# Altium project Position2Go_V1.3.PrjPcb
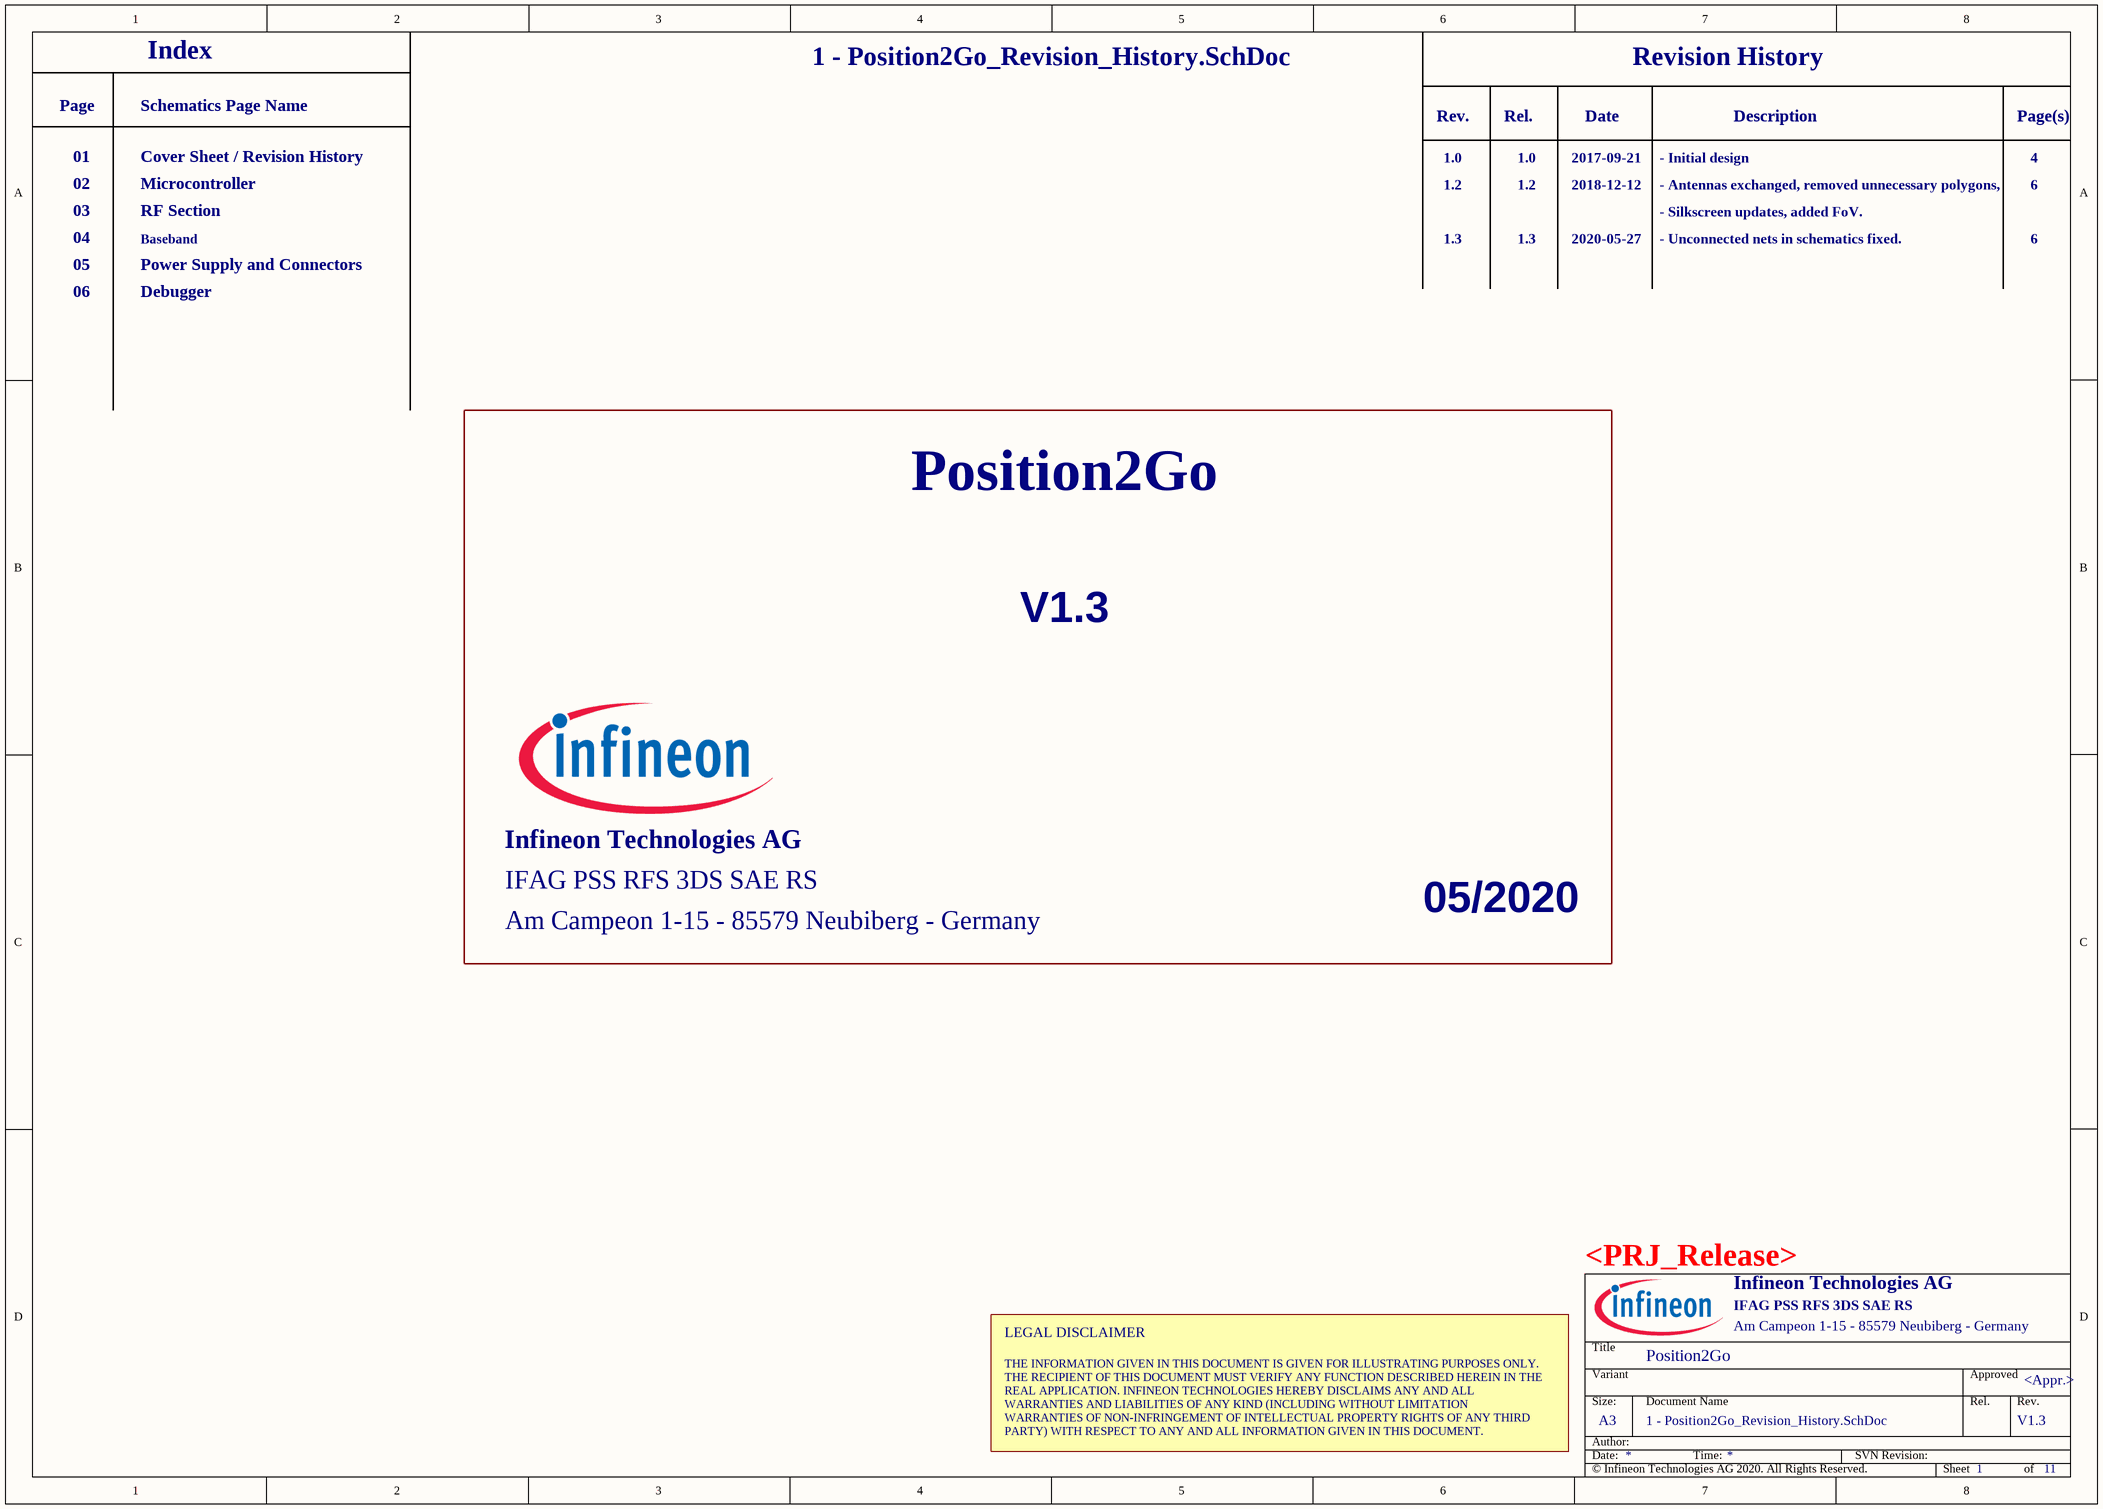
[diagram p0: 1 - Position2Go_Revision_History.SchDoc]
PRJ_Address1: IFAG PSS RFS 3DS SAE RS; PRJ_Address2: Am Campeon 1-15 - 85579 Neubiberg - Germany; PRJ_ConfidentialStatus: <PRJ_Release>; PRJ_Copyright: © Infineon Technologies AG 2020. All Rights Reserved.; PRJ_Organization: Infineon Technologies AG; PRJ_PCB_Release: V1.2; PRJ_PCB_Revision: V1.2; PRJ_SCH_Authon: Infineon Radar Team; PRJ_SCH_Revision: V1.3; PRJ_Title: Position2Go; PRJ_Year: 05/2020
6 sheets, 273 parts. Net scope: flat (ports and power ports of the same name join across sheets).
Board file: Position2Go_V1.2.PcbDoc
Sheets:
  1 - Position2Go_Revision_History.SchDoc
  2 - Position2Go_Microcontroller.SchDoc
  3 - Position2Go_RF_Section.SchDoc
  4 - Position2Go_Baseband.SchDoc
  5 - Position2Go_PowerSupply_and_Connectors.SchDoc
  6 - Position2Go_Debugger.SchDoc

## Sheet 1 - Position2Go_Revision_History.SchDoc: <Project Name>
size A3; ApprovedBy: <Appr.>; Author: <Author>; CompanyName: Infineon Technologies AG; Engineer: <Rel.>; Organization: Infineon Technologies AG; Address1: IFAG PMM RFS MM AE; Address2: Am Campeon 1-12  -  85579 Neubiberg  -  Germany; Address3: 85579 Neubiberg; Address4: Germany; DocumentNumber: 1; Revision: <Rev.>; SheetNumber: 1; SheetTotal: 11; Release: RC00; PageSetup: Record=PageOptions|CenterHorizontal=True|CenterVertical=True|PrintScale=1.01|XCorrection=1.00|YCorrection=1.00|PrintKind=0|BorderSize=5000000|LeftOffset=0|BottomOffset=0|Orientation=2|PaperLength=1000|PaperWidth=1000|Scale=100|PaperSource=7|PrintQuality=-4|MediaType=1|DitherType=10|PaperKind=A3|PrintScaleMode=1; Doc_ConfidentialStatus: <Confidential>; Doc_Preliminary: <Doc_Preliminary>

### Notes on the sheet
- Page
- Schematics Page Name
- Index
- Revision History
- 01
- Cover Sheet / Revision History
- Rev.
- 1.0
- Rel.
- 2017-09-21
- Date
- - Initial design
- Description
- Page(s)
- 4
- 03
- 02
- 04
- Microcontroller
- RF Section
- Baseband
- 1.2
- 1.3
- 2018-12-12
- 2020-05-27
- - Antennas exchanged, removed unnecessary polygons,
- - Silkscreen updates, added FoV.
- - Unconnected nets in schematics fixed.
- 6
- 05
- 06
- Power Supply and Connectors
- Debugger
- LEGAL DISCLAIMER
- THE INFORMATION GIVEN IN THIS DOCUMENT IS GIVEN FOR ILLUSTRATING PURPOSES ONLY.
  THE RECIPIENT OF THIS DOCUMENT MUST VERIFY ANY FUNCTION DESCRIBED HEREIN IN THE
  REAL APPLICATION. INFINEON TECHNOLOGIES HEREBY DISCLAIMS ANY AND ALL
  WARRANTIES AND LIABILITIES OF ANY KIND (INCLUDING WITHOUT LIMITATION
  WARRANTIES OF NON-INFRINGEMENT OF INTELLECTUAL PROPERTY RIGHTS OF ANY THIRD
  PARTY) WITH RESPECT TO ANY AND ALL INFORMATION GIVEN IN THIS DOCUMENT.
- Title
- Variant
- Approved
- Date:
- Author:
- Size:
- A3
- Document Name
- Time:
- SVN Revision:
- Sheet
- of

## Sheet 2 - Position2Go_Microcontroller.SchDoc
size A3; Release: RC00; PageSetup: Record=PageOptions|CenterHorizontal=True|CenterVertical=True|PrintScale=1.01|XCorrection=1.00|YCorrection=1.00|PrintKind=0|BorderSize=5000000|LeftOffset=0|BottomOffset=0|Orientation=2|PaperLength=1000|PaperWidth=1000|Scale=100|PaperSource=7|PrintQuality=-4|MediaType=1|DitherType=10|PaperKind=A3|PrintScaleMode=1; Doc_ConfidentialStatus: <Doc_ConfidentialStatus>; Doc_Preliminary: <Doc_Preliminary>
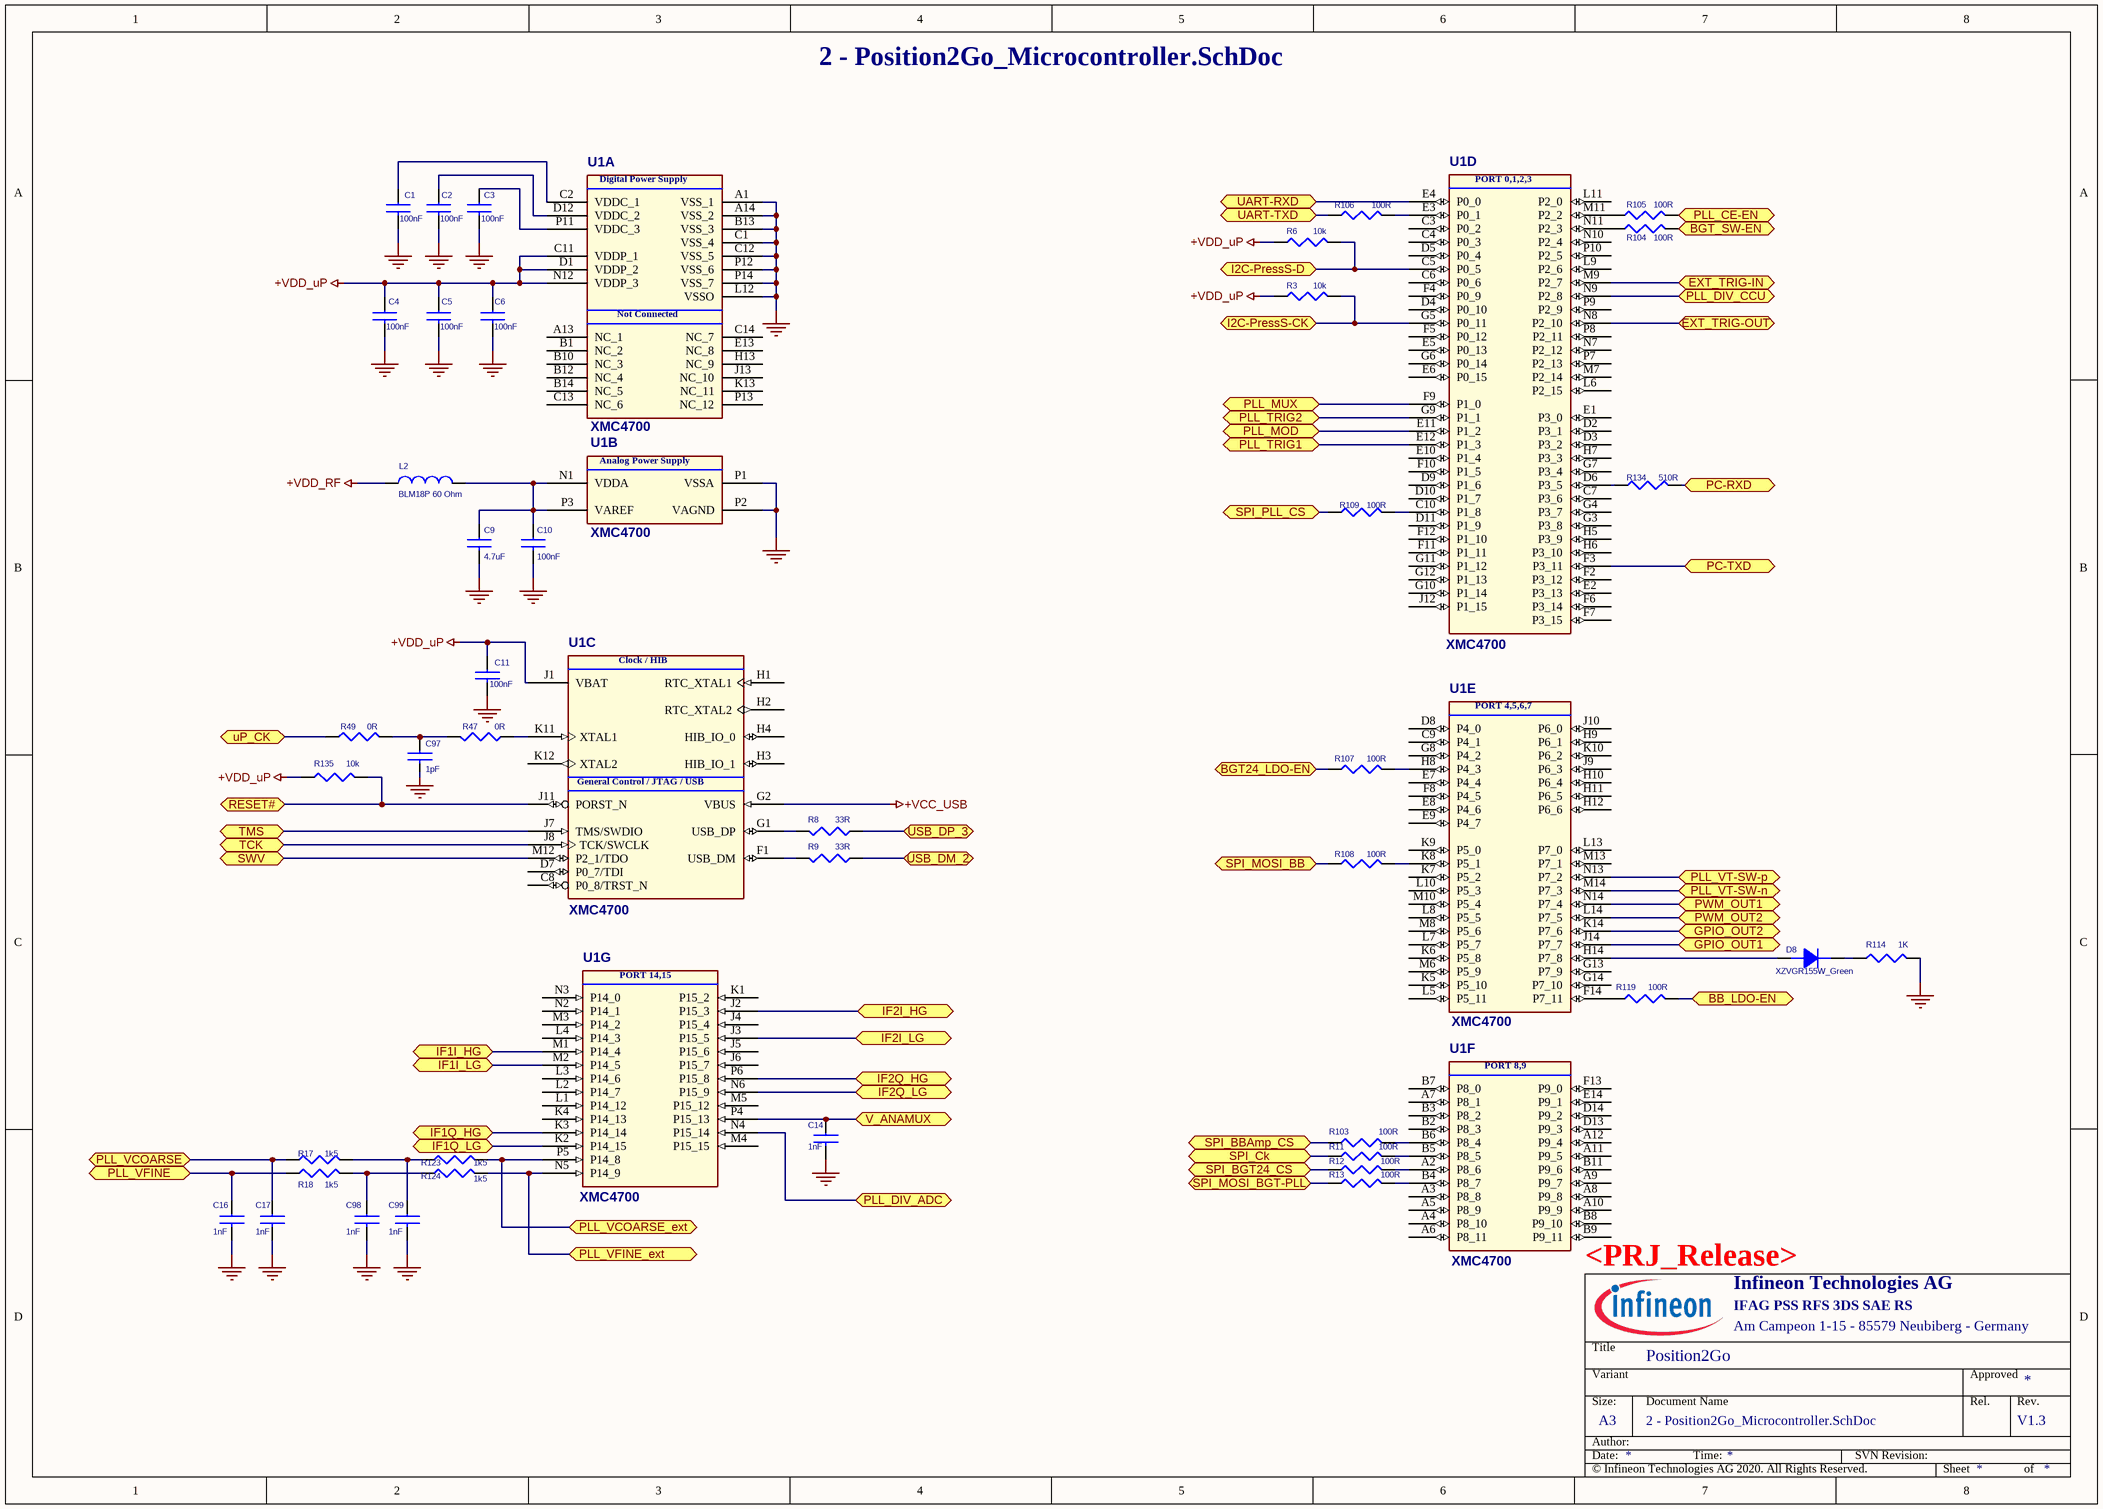
[diagram p1: 2 - Position2Go_Microcontroller.SchDoc]

### Parts
C1  100nF  [C_0201]
C2  100nF  [C_0201]
C3  100nF  [C_0201]
C4  100nF  [C_0201]
C5  100nF  [C_0201]
C6  100nF  [C_0201]
C9  4.7uF  [0402_durac]
C10  100nF  [C_0201]
C11  100nF  [C_0201]
C14  1nF  [C_0201]
C16  1nF  [C_0201]
C17  1nF  [C_0201]
C97  1pF  [C_0201]
C98  1nF  [0402_durac]
C99  1nF  [0402_durac]
D8  XZVGR155W_Green  [LED_0201]
L2  BLM18P 60 Ohm  [L_0603]
R3  10k  [R_0201]
R6  10k  [R_0201]
R8  33R  [0402_durac]
R9  33R  [0402_durac]
R11  100R  [R_0201]
R12  100R  [R_0201]
R13  100R  [R_0201]
R17  1k5  [R_0201]
R18  1k5  [R_0201]
R47  0R  [R_0201]
R49  0R  [R_0201]
R103  100R  [R_0201]
R104  100R  [R_0201]
R105  100R  [R_0201]
R106  100R  [R_0201]
R107  100R  [R_0201]
R108  100R  [R_0201]
R109  100R  [R_0201]
R114  1K  [R_0201]
R119  100R  [R_0201]
R123  1k5  [R_0201]
R124  1k5  [R_0201]
R134  510R  [0402_durac]
R135  10k  [R_0201]
U1  XMC4700  [BGA196C80P14X14_1200X1200X170]  (parts A,B,C,D,E,F,G of 7)

### Ports
BB_LDO-EN (bidir), BGT24_LDO-EN (bidir), BGT_SW-EN (bidir), EXT_TRIG-IN (bidir), EXT_TRIG-OUT (bidir), GPIO_OUT1 (bidir), GPIO_OUT2 (bidir), I2C-PressS-CK (bidir), I2C-PressS-D (bidir), IF1I_HG (bidir), IF1I_LG (bidir), IF1Q_HG (bidir), IF1Q_LG (bidir), IF2I_HG (bidir), IF2I_LG (bidir), IF2Q_HG (bidir), IF2Q_LG (bidir), PC-RXD (bidir), PC-TXD (bidir), PLL_CE-EN (bidir), PLL_DIV_ADC (bidir), PLL_DIV_CCU (bidir), PLL_MOD (bidir), PLL_MUX (bidir), PLL_TRIG1 (bidir), PLL_TRIG2 (bidir), PLL_VCOARSE (bidir), PLL_VCOARSE_ext (bidir), PLL_VFINE (bidir), PLL_VFINE_ext (bidir), PLL_VT-SW-n (bidir), PLL_VT-SW-p (bidir), PWM_OUT1 (bidir), PWM_OUT2 (bidir), RESET# (bidir), SPI_BBAmp_CS (bidir), SPI_BGT24_CS (bidir), SPI_Ck (bidir), SPI_MOSI_BB (bidir), SPI_MOSI_BGT-PLL (bidir), SPI_PLL_CS (bidir), SWV (bidir), TCK (bidir), TMS (bidir), UART-RXD (bidir), UART-TXD (bidir), uP_CK (bidir), USB_DM_2 (bidir), USB_DP_3 (bidir), V_ANAMUX (bidir)

### Nets
+VCC_USB: U1.G2(VBUS)
+VDD_RF: L2.1
+VDD_uP: C4.1 C5.1 C6.1 C11.1 R3.1 R6.2 R135.2 U1.C11(VDDP_1) U1.D1(VDDP_2) U1.J1(VBAT) U1.N12(VDDP_3)
GND_POWER: C1.2 C2.2 C3.2 C4.2 C5.2 C6.2 C9.2 C10.2 C11.2 C14.2 C16.2 C17.2 C97.2 C98.2 C99.2 R114.1 U1.A1(VSS_1) U1.A14(VSS_2) U1.B13(VSS_3) U1.C1(VSS_4) U1.C12(VSS_5) U1.L12(VSSO) U1.P1(VSSA) U1.P2(VAGND) U1.P12(VSS_6) U1.P14(VSS_7)
NetC1_1: C1.1 U1.C2(VDDC_1)
NetC2_1: C2.1 U1.D12(VDDC_2)
NetC3_1: C3.1 U1.P11(VDDC_3)
NetC9_1: C9.1 C10.1 L2.2 U1.N1(VDDA) U1.P3(VAREF)
NetC14_1: C14.1 U1.P4(P15_13) ; port V_ANAMUX
NetC16_1: C16.1 R18.1 ; port PLL_VFINE
NetC17_1: C17.1 R17.1 ; port PLL_VCOARSE
NetC43_2: R49.2 ; port uP_CK
NetC47_2: U1.M2(P14_5) ; port IF1I_LG
NetC56_2: U1.K2(P14_15) ; port IF1Q_LG
NetC66_2: U1.J3(P15_5) ; port IF2I_LG
NetC73_2: U1.N6(P15_9) ; port IF2Q_LG
NetC93_1: U1.J2(P15_3) ; port IF2I_HG
NetC94_1: U1.P6(P15_8) ; port IF2Q_HG
NetC95_1: U1.K3(P14_14) ; port IF1Q_HG
NetC96_1: U1.M1(P14_4) ; port IF1I_HG
NetC97_1: C97.1 R47.2 R49.1
NetC98_1: C98.1 R18.2 R124.1
NetC99_1: C99.1 R17.2 R123.1
NetD8_1: D8.1(K) R114.2
NetD8_2: D8.2(A) U1.H14(P7_8)
NetJ1_1: R109.2 ; port SPI_PLL_CS
NetJ1_2: R13.1 ; port SPI_MOSI_BGT-PLL
NetJ1_3: R11.1 ; port SPI_Ck
NetJ1_4: R12.1 ; port SPI_BGT24_CS
NetJ1_6: R106.1 ; port UART-TXD
NetJ1_7: U1.E4(P0_0) ; port UART-RXD
NetJ1_8: U1.J14(P7_7) ; port GPIO_OUT1
NetJ1_9: U1.M9(P2_7) ; port EXT_TRIG-IN
NetJ1_10: U1.K14(P7_6) ; port GPIO_OUT2
NetJ1_11: U1.L14(P7_5) ; port PWM_OUT2
NetJ1_12: U1.N14(P7_4) ; port PWM_OUT1
NetJ2_3: R123.2 U1.P5(P14_8) ; port PLL_VCOARSE_ext
NetJ2_4: R124.2 U1.N5(P14_9) ; port PLL_VFINE_ext
NetJ2_5: U1.F9(P1_0) ; port PLL_MUX
NetJ2_6: U1.E11(P1_2) ; port PLL_MOD
NetJ3_2: R9.1 ; port USB_DM_2
NetJ3_3: R8.1 ; port USB_DP_3
NetJ6_2: U1.J7(TMS/SWDIO) ; port TMS
NetJ6_4: U1.J8(TCK/SWCLK) ; port TCK
NetJ6_6: U1.M12(P2_1/TDO) ; port SWV
NetJ6_10: R135.1 U1.J11(PORST_N) ; port RESET#
NetQ1_3: R104.2 ; port BGT_SW-EN
NetR3_2: R3.2 U1.G5(P0_11) ; port I2C-PressS-CK
NetR6_1: R6.1 U1.C5(P0_5) ; port I2C-PressS-D
NetR8_2: R8.2 U1.G1(USB_DP)
NetR9_2: R9.2 U1.F1(USB_DM)
NetR11_2: R11.2 U1.B5(P8_5)
NetR12_2: R12.2 U1.A2(P8_6)
NetR13_2: R13.2 U1.B4(P8_7)
NetR24_1: U1.N13(P7_2) ; port PLL_VT-SW-p
NetR34_1: U1.M14(P7_3) ; port PLL_VT-SW-n
NetR37_1: U1.N9(P2_8) ; port PLL_DIV_CCU
NetR47_1: R47.1 U1.K11(XTAL1)
NetR61_2: R108.1 ; port SPI_MOSI_BB
NetR63_2: R103.1 ; port SPI_BBAmp_CS
NetR91_2: U1.F3(P3_11) ; port PC-TXD
NetR103_2: R103.2 U1.B6(P8_4)
NetR104_1: R104.1 U1.N11(P2_3)
NetR105_1: R105.1 U1.M11(P2_2)
NetR105_2: R105.2 ; port PLL_CE-EN
NetR106_2: R106.2 U1.E3(P0_1)
NetR107_1: R107.1 ; port BGT24_LDO-EN
NetR107_2: R107.2 U1.H8(P4_3)
NetR108_2: R108.2 U1.K8(P5_1)
NetR109_1: R109.1 U1.C10(P1_8)
NetR119_1: R119.1 ; port BB_LDO-EN
NetR119_2: R119.2 U1.F14(P7_11)
NetR132_1: U1.N4(P15_14) ; port PLL_DIV_ADC
NetR134_1: R134.1 U1.D6(P3_5)
NetR134_2: R134.2 ; port PC-RXD
NetU1_E12: U1.E12(P1_3) ; port PLL_TRIG1
NetU1_G9: U1.G9(P1_1) ; port PLL_TRIG2
NetU1_N8: U1.N8(P2_10) ; port EXT_TRIG-OUT

Not connected (* = marked no-connect by the designer): U1 A3(P8_8) A4(P8_10) A5(P8_9) A6(P8_11) A7(P8_1) A8(P9_8) A9(P9_7) A10(P9_9) A11(P9_5) A12(P9_4) A13(NC_1) B1(NC_2) B2(P8_3) B3(P8_2) B7(P8_0) B8(P9_10) B9(P9_11) B10(NC_3) B11(P9_6) B12(NC_4) B14(NC_5) C3(P0_2) C4(P0_3) C6(P0_6) C7(P3_6) C8(P0_8/TRST_N) C9(P4_1) C13(NC_6) C14(NC_7) D2(P3_1) D3(P3_2) D4(P0_10) D5(P0_4) D7(P0_7/TDI) D8(P4_0) D9(P1_6) D10(P1_7) D11(P1_9) D13(P9_3) D14(P9_2) E1(P3_0) E2(P3_13) E5(P0_13) E6(P0_15) E7(P4_4) E8(P4_6) E9(P4_7) E10(P1_4) E13(NC_8) E14(P9_1) F2(P3_12) F4(P0_9) F5(P0_12) F6(P3_14) F7(P3_15) F8(P4_5) F10(P1_5) F11(P1_11) F12(P1_10) F13(P9_0) G3(P3_8) G4(P3_7) G6(P0_14) G7(P3_4) G8(P4_2) G10(P1_14) G11(P1_12) G12(P1_13) G13(P7_9) G14(P7_10) H1(RTC_XTAL1) H2(RTC_XTAL2) H3(HIB_IO_1) H4(HIB_IO_0) H5(P3_9) H6(P3_10) H7(P3_3) H9(P6_1) H10(P6_4) H11(P6_5) H12(P6_6) H13(NC_9) J4(P15_4) J5(P15_6) J6(P15_7) J9(P6_3) J10(P6_0) J12(P1_15) J13(NC_10) K1(P15_2) K4(P14_13) K5(P5_10) K6(P5_8) K7(P5_2) K9(P5_0) K10(P6_2) K12(XTAL2) K13(NC_11) L1(P14_12) L2(P14_7) L3(P14_6) L4(P14_3) L5(P5_11) L6(P2_15) L7(P5_7) L8(P5_5) L9(P2_6) L10(P5_3) L11(P2_0) L13(P7_0) M3(P14_2) M4(P15_15) M5(P15_12) M6(P5_9) M7(P2_14) M8(P5_6) M10(P5_4) M13(P7_1) N2(P14_1) N3(P14_0) N7(P2_12) N10(P2_4) P7(P2_13) P8(P2_11) P9(P2_9) P10(P2_5) P13(NC_12)

### Notes on the sheet
- Title
- Variant
- Approved
- Date:
- Author:
- Size:
- A3
- Document Name
- Time:
- SVN Revision:
- Rel.
- Rev.
- Sheet
- of
- (in symbol XMC4700-E196F2048, part A) Digital Power Supply; Not Connected
- (in symbol XMC4700-E196F2048, part B) Analog Power Supply
- (in symbol XMC4700-E196F2048, part C) Clock / HIB; General Control / JTAG / USB
- (in symbol XMC4700-E196F2048, part D) PORT 0,1,2,3
- (in symbol XMC4700-E196F2048, part E) PORT 4,5,6,7
- (in symbol XMC4700-E196F2048, part F) PORT 8,9
- (in symbol XMC4700-E196F2048, part G) PORT 14,15

### Library data of the parts
C1-C6 C10 C11 = 100nF_Dup1: 100nF  ±10%  35V  X5R; code_DK: 490-10430-1-ND; Voltage: 35V; Part Type: capacitor\ceramic; Tolerance: 10%
C9 = 4.7UF: code_DK: 445-13820-1-ND; Voltage: 10V; Tolerance: 10%; Temperature coefficient: X5R; Part Type: capacitor\ceramic
C14 C16 C17 = 1nF: Tolerance: 10%; Voltage: 25V; code_DK: 445-4695-1-ND; Part Type: capacitor\ceramic
C97 = 1pF: Tolerance: ±0,1 pF; Voltage: 25V; code_DK: 712-1181-1-ND; Part Type: capacitor\ceramic
C98 C99 = 1.0nF: code_DK: 490-3244-2-ND; Voltage: 50V; Tolerance: 5%; Temperature coefficient: NP0; code_GW: GW_0144; Part Type: capacitor\ceramic; code_DK_Reel: 490-3244-2-ND
D8 = LED_0201_GREEN: code_DK_reel: 475-1193-6-ND; code_DK: 1497-1300-1-ND
L2 = blm18 p 60 ohm: code_DK: 490-1036-1-ND
R3 R6 R135 = 10K_Dup1: code_DK_reel: 311-1KMDKR-ND; code_DK: 311-10.0KMCT-ND; tolerance: 1%; Power: 0.063W; size: 0201
R8 R9 = RESISTOR: code_DK: 311-33.0LRTR-ND
R11-R13 R103-R109 R119 = 100: code_DK: 311-100MCT-ND; tolerance: 1%; Power: 0.063W; size: 0201
R17 R18 R123 R124 = 1k5: tolerance: 1%; Power: 0.063W; size: 0201
R47 R49 = 0_Dup2: code_DK: 311-0.0NCT-ND; tolerance: 1%; Power: 0.063W; size: 0201
R114 = 1K: Power: 0.063W; tolerance: 1%; code_DK: 311-1KMCT-ND; size: 0201
R134 = 510: Power: 0.063W; tolerance: 1%; code_DK: 311-510LRTR-ND; size: 0402
U1 = XMC4700-E196F2048: code_DK: XMC4700E196K2048AAXQMA1-ND

## Sheet 3 - Position2Go_RF_Section.SchDoc
size A3; Release: RC00; PageSetup: Record=PageOptions|CenterHorizontal=True|CenterVertical=True|PrintScale=1.01|XCorrection=1.00|YCorrection=1.00|PrintKind=0|BorderSize=5000000|LeftOffset=0|BottomOffset=0|Orientation=2|PaperLength=1000|PaperWidth=1000|Scale=100|PaperSource=7|PrintQuality=-4|MediaType=1|DitherType=10|PaperKind=A3|PrintScaleMode=1; Doc_ConfidentialStatus: <Doc_ConfidentialStatus>; Doc_Preliminary: <Doc_Preliminary>
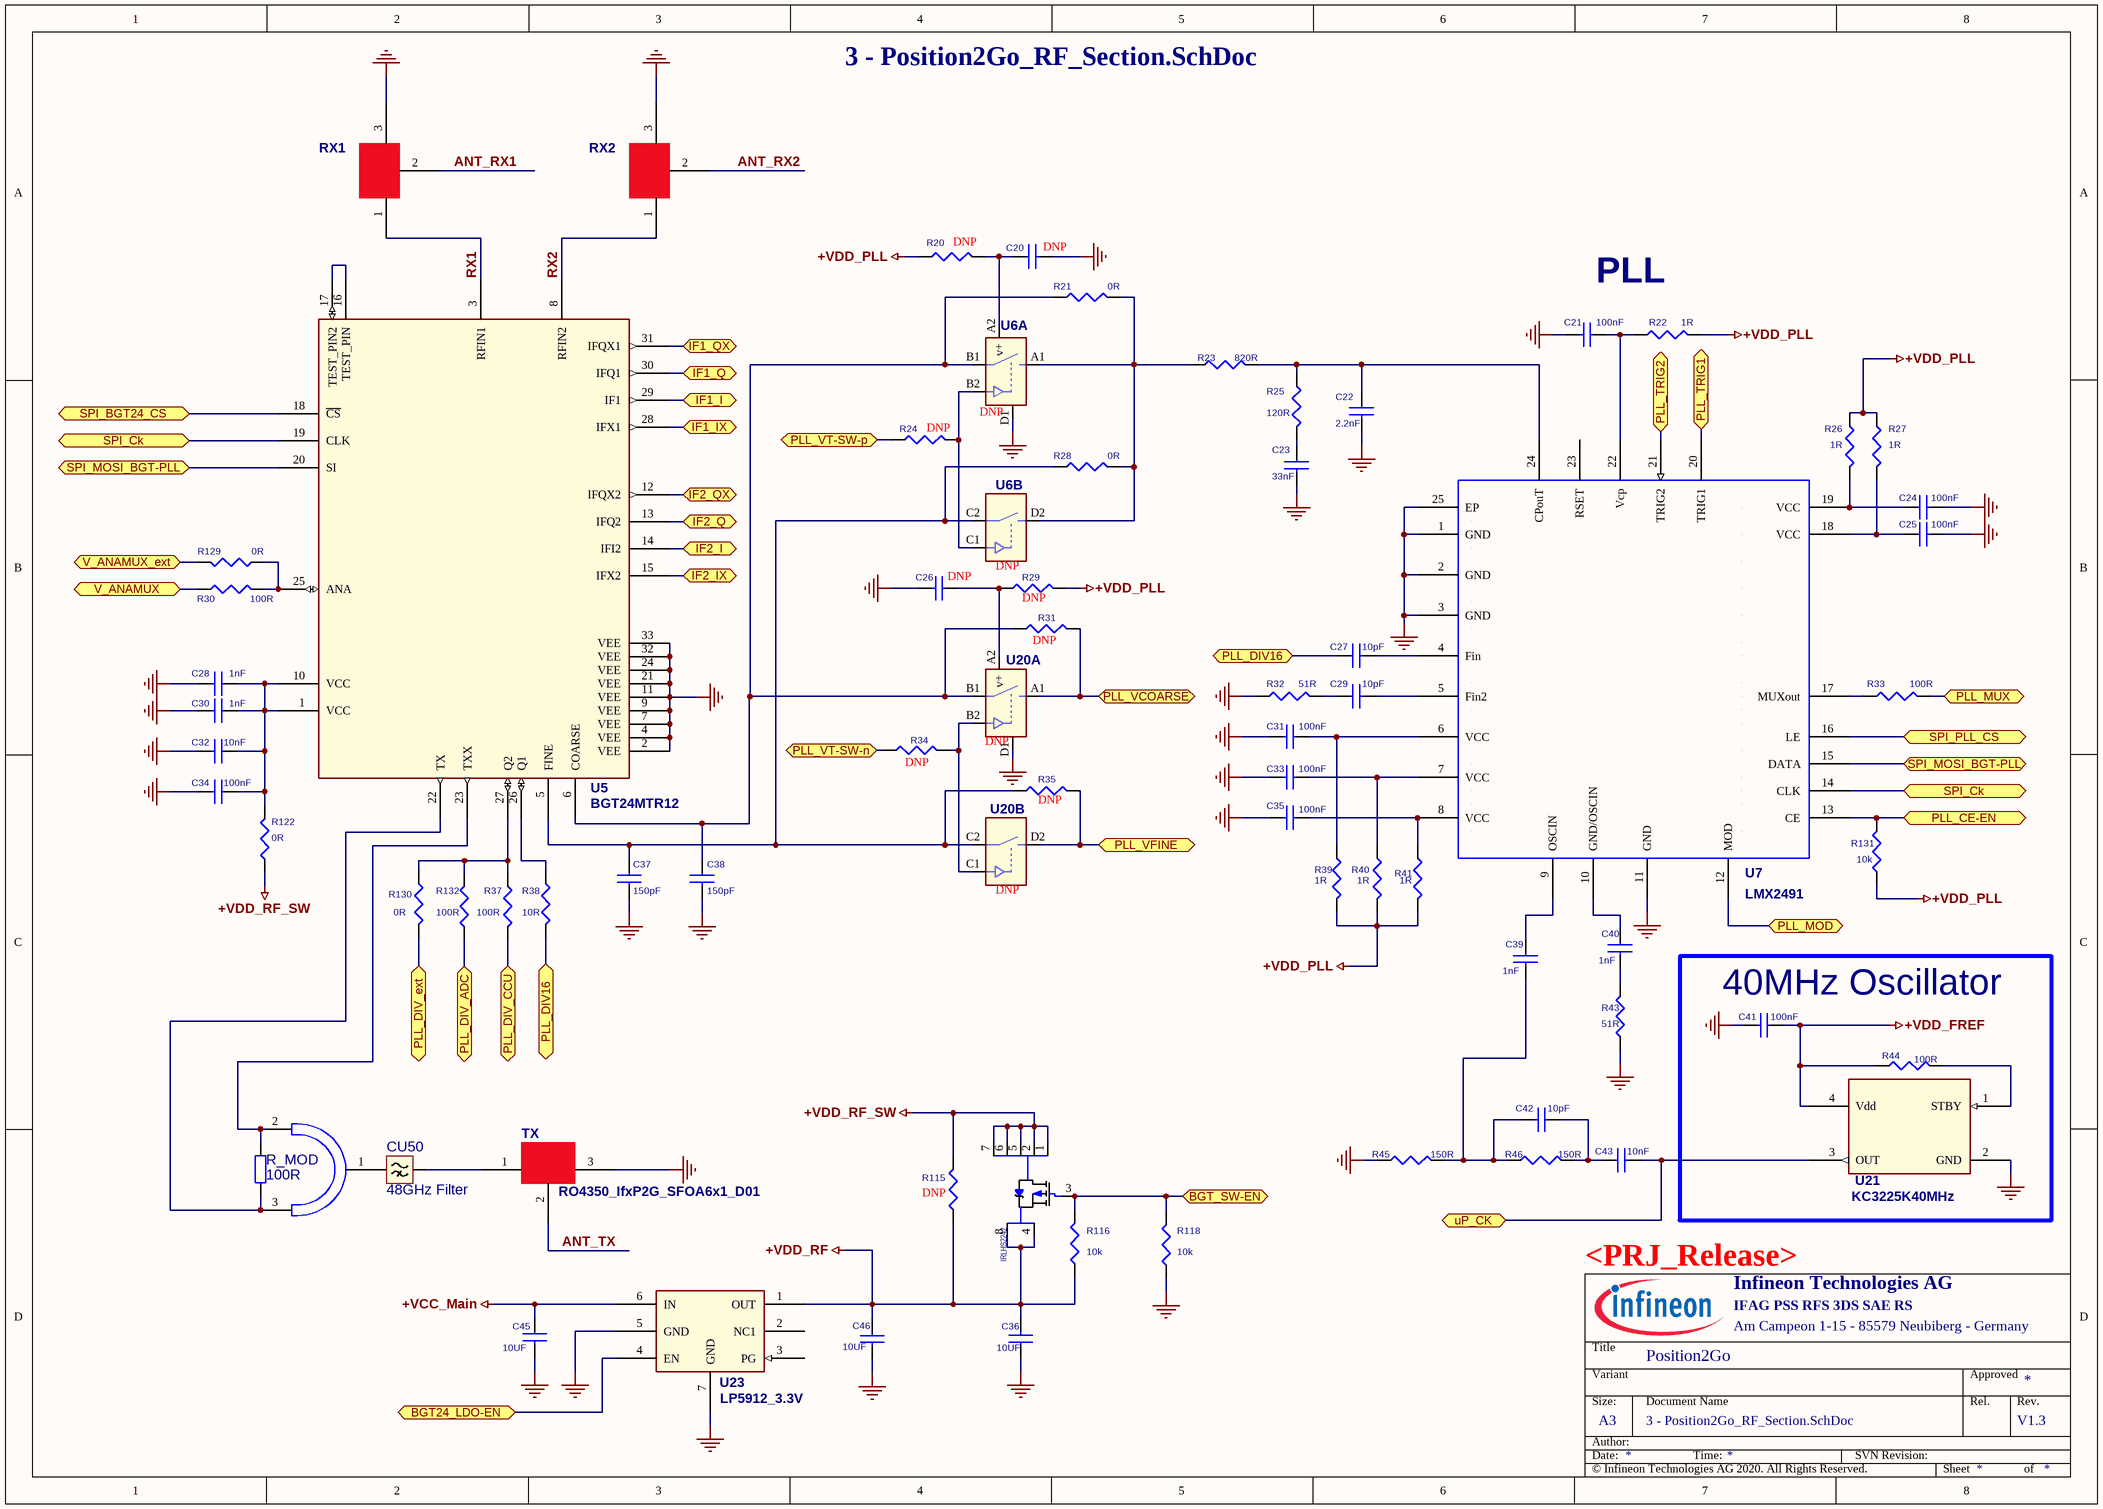
[diagram p2: 3 - Position2Go_RF_Section.SchDoc]

### Parts
C20  DNP  [C_0201]  (value not drawn)
C21  100nF  [C_0201]
C22  2.2nF  [0402_durac]
C23  33nF  [0402_durac]
C24  100nF  [C_0201]
C25  100nF  [C_0201]
C26  DNP  [C_0201]  (value not drawn)
C27  10pF  [C_0201]
C28  1nF  [C_0201]
C29  10pF  [C_0201]
C30  1nF  [C_0201]
C31  100nF  [C_0201]
C32  10nF  [C_0201]
C33  100nF  [C_0201]
C34  100nF  [C_0201]
C35  100nF  [C_0201]
C36  10UF  [0402_durac]
C37  150pF  [C_0201]
C38  150pF  [C_0201]
C39  1nF  [C_0201]
C40  1nF  [C_0201]
C41  100nF  [C_0201]
C42  10pF  [C_0201]
C43  10nF  [C_0201]
C45  10UF  [0402_durac]
C46  10UF  [0402_durac]
CU1  Divider  [WILKSON]  (value not drawn)  (net tie, no BOM)
CU50  48GHz Filter  [48GHz_Filter]  (net tie, no BOM)
Q1  IRLHS2242  [IRLSH2242]  (value not drawn)
R20  DNP  [R_0201]  (value not drawn)
R21  0R  [R_0201]
R22  1R  [R_0201]
R23  820R  [0402_durac]
R24  DNP  [R_0201]  (value not drawn)
R25  120R  [0402-A]
R26  1R  [R_0201]
R27  1R  [R_0201]
R28  0R  [R_0201]
R29  DNP  [R_0201]  (value not drawn)
R30  100R  [R_0201]
R31  DNP  [R_0201]  (value not drawn)
R32  51R  [R_0201]
R33  100R  [R_0201]
R34  DNP  [R_0201]  (value not drawn)
R35  DNP  [R_0201]  (value not drawn)
R37  100R  [R_0201]
R38  10R  [R_0201]
R39  1R  [R_0201]
R40  1R  [R_0201]
R41  1R  [R_0201]
R43  51R  [R_0201]
R44  100R  [R_0201]
R45  150R  [R_0201]
R46  150R  [R_0201]
R115  DNP  [R_0201]  (value not drawn)
R116  10k  [R_0201]
R118  10k  [R_0201]
R122  0R  [0603]
R129  0R  [R_0201]
R130  0R  [R_0201]
R131  10k  [R_0201]
R132  100R  [R_0201]
R_MOD  value 100R  [24GHZ_Wilkinson_R]  (hidden comment: RES-100R-50V-1%-0603)
RX1  RO4350_IfxP2G_SFOA6x1_D01  [RO4350_IfxP2G_SFPA6x1_D01_RX1_L]  (value not drawn)  (net tie, no BOM)
RX2  RO4350_IfxP2G_SFOA6x1_D01  [RO4350_IfxP2G_SFPA6x1_D01_RX1]  (value not drawn)  (net tie, no BOM)
TX  RO4350_IfxP2G_SFOA6x1_D01  [RO4350_IfxP2G_SFPA6x1_D01_Tx]  (net tie, no BOM)
U5  BGT24MTR12  [VQFN32-9]
U6  DNP  [OPA2376_DSBGA]  (value not drawn)  (parts A,B of 2)
U7  LMX2491  [VFQN_24]
U20  DNP  [OPA2376_DSBGA]  (value not drawn)  (parts A,B of 2)
U21  KC3225K40MHz  [3525_40MHz]
U23  LP5912_3.3V  [DRV6_1P6X1]

### Blocks framed on the sheet
40MHz Oscillator: C41 R44 U21

### Ports
BGT24_LDO-EN (bidir), BGT_SW-EN (bidir), IF1_I (bidir), IF1_IX (bidir), IF1_Q (bidir), IF1_QX (bidir), IF2_I (bidir), IF2_IX (bidir), IF2_Q (bidir), IF2_QX (bidir), PLL_CE-EN (bidir), PLL_DIV16 (bidir), PLL_DIV_ADC (bidir), PLL_DIV_CCU (bidir), PLL_DIV_ext (bidir), PLL_MOD (bidir), PLL_MUX (bidir), PLL_TRIG1 (bidir), PLL_TRIG2 (bidir), PLL_VCOARSE (bidir), PLL_VFINE (bidir), PLL_VT-SW-n (bidir), PLL_VT-SW-p (bidir), SPI_BGT24_CS (bidir), SPI_Ck (bidir), SPI_MOSI_BGT-PLL (bidir), SPI_PLL_CS (bidir), uP_CK (bidir), V_ANAMUX (bidir), V_ANAMUX_ext (bidir)

### Nets
+VCC_Main: C45.1 U23.6(IN)
+VDD_FREF: C41.1 R44.2 U21.4(Vdd)
+VDD_PLL: R20.2 R22.2 R26.1 R27.1 R29.2 R39.2 R40.2 R41.2 R131.1
+VDD_RF: C36.2 C46.1 Q1.4(source) Q1.8(source) R115.1 R116.1 U23.1(OUT)
+VDD_RF_SW: Q1.1(DRAIN) Q1.2(DRAIN) Q1.5(DRAIN) Q1.6(DRAIN) Q1.7(DRAIN) R115.2 R122.1
GND_POWER: C20.2 C21.2 C22.2 C23.2 C24.2 C25.2 C26.2 C28.2 C30.2 C31.2 C32.2 C33.2 C34.2 C35.2 C36.1 C37.2 C38.2 C41.2 C45.2 C46.2 R32.1 R43.1 R45.2 R118.1 RX1.3 RX2.3 TX.3 U5.2(VEE) U5.4(VEE) U5.7(VEE) U5.9(VEE) U5.11(VEE) U5.21(VEE) U5.24(VEE) U5.32(VEE) U5.33(VEE) U6.D1(GND) U7.1(GND) U7.2(GND) U7.3(GND) U7.11(GND) U7.25(EP) U20.D1(GND) U21.2(GND) U23.5(GND) U23.7(GND)
ANT_RX1: RX1.2
ANT_RX2: RX2.2
ANT_TX: TX.2
RX1: RX1.1 U5.3(RFIN1)
RX2: RX2.1 U5.8(RFIN2)
NetC14_1: R30.1 ; port V_ANAMUX
NetC16_1: R35.2 U20.D2(NO2) ; port PLL_VFINE
NetC17_1: R31.2 U20.A1(NO1) ; port PLL_VCOARSE
NetC20_1: C20.1 R20.1 U6.A2(v+)
NetC21_1: C21.1 R22.1 U7.22(Vcp)
NetC22_1: C22.1 R23.2 R25.1 U7.24(CPouT)
NetC23_1: C23.1 R25.2
NetC24_1: C24.1 R26.2 U7.19(VCC)
NetC25_1: C25.1 R27.2 U7.18(VCC)
NetC26_1: C26.1 R29.1 U20.A2(v+)
NetC27_1: C27.1 R38.2 ; port PLL_DIV16
NetC27_2: C27.2 U7.4(Fin)
NetC28_1: C28.1 C30.1 C32.1 C34.1 R122.2 U5.1(VCC) U5.10(VCC)
NetC29_1: C29.1 R32.2
NetC29_2: C29.2 U7.5(Fin2)
NetC31_1: C31.1 R39.1 U7.6(VCC)
NetC33_1: C33.1 R40.1 U7.7(VCC)
NetC35_1: C35.1 R41.1 U7.8(VCC)
NetC37_1: C37.1 R28.1 R35.1 U5.5(FINE) U6.C2(COM2) U20.C2(COM2)
NetC38_1: C38.1 R21.1 R31.1 U5.6(COARSE) U6.B1(COM1) U20.B1(COM1)
NetC39_1: C39.1 U7.9(OSCIN)
NetC39_2: C39.2 C42.2 R45.1 R46.2
NetC40_1: C40.1 U7.10(GND/OSCIN)
NetC40_2: C40.2 R43.2
NetC42_1: C42.1 C43.1 R46.1
NetC43_2: C43.2 U21.3(OUT) ; port uP_CK
NetC49_1: U5.28(IFX1) ; port IF1_IX
NetC52_1: U5.29(IF1) ; port IF1_I
NetC60_1: U5.31(IFQX1) ; port IF1_QX
NetC61_1: U5.30(IFQ1) ; port IF1_Q
NetC67_1: U5.15(IFX2) ; port IF2_IX
NetC70_1: U5.14(IFI2) ; port IF2_I
NetC77_1: U5.12(IFQX2) ; port IF2_QX
NetC78_1: U5.13(IFQ2) ; port IF2_Q
NetCU1_1: CU1.1(P1) CU50.2
NetCU1_2: CU1.2(P2) R_MOD.1(P1) U5.23(TXX)
NetCU1_3: CU1.3(P3) R_MOD.2(P2) U5.22(TX)
NetCU50_1: CU50.1 TX.1
NetJ1_1: U7.16(LE) ; port SPI_PLL_CS
NetJ1_2: U5.20(SI) U7.15(DATA) ; port SPI_MOSI_BGT-PLL
NetJ1_3: U5.19(CLK) U7.14(CLK) ; port SPI_Ck
NetJ1_4: U5.18(~{CS}) ; port SPI_BGT24_CS
NetJ1_5: R130.2 ; port PLL_DIV_ext
NetJ2_5: R33.2 ; port PLL_MUX
NetJ2_6: U7.12(MOD) ; port PLL_MOD
NetJ2_11: R129.2 ; port V_ANAMUX_ext
NetQ1_3: Q1.3(GATE) R116.2 R118.2 ; port BGT_SW-EN
NetR21_2: R21.2 R23.1 R28.2 U6.A1(NO1) U6.D2(NO2)
NetR24_1: R24.1 ; port PLL_VT-SW-p
NetR24_2: R24.2 U6.B2(IN1) U6.C1(IN2)
NetR30_2: R30.2 R129.1 U5.25(ANA)
NetR33_1: R33.1 U7.17(MUXout)
NetR34_1: R34.1 ; port PLL_VT-SW-n
NetR34_2: R34.2 U20.B2(IN1) U20.C1(IN2)
NetR37_1: R37.1 ; port PLL_DIV_CCU
NetR37_2: R37.2 R130.1 R132.2 U5.27(Q2)
NetR38_1: R38.1 U5.26(Q1)
NetR44_1: R44.1 U21.1(STBY)
NetR105_2: R131.2 U7.13(CE) ; port PLL_CE-EN
NetR107_1: U23.4(EN) ; port BGT24_LDO-EN
NetR132_1: R132.1 ; port PLL_DIV_ADC
NetU1_E12: U7.20(TRIG1) ; port PLL_TRIG1
NetU1_G9: U7.21(TRIG2) ; port PLL_TRIG2
NetU5_16: U5.16(TEST_PIN) U5.17(TEST_PIN2)

Not connected (* = marked no-connect by the designer): U7 23(RSET); U23 2(NC1) 3(PG)

### Notes on the sheet
- (near R20) DNP
- (near C20) DNP
- PLL
- (near R24) DNP
- (near U6) DNP
- (near C26) DNP
- DNP
- (near R29) DNP
- (near R31) DNP
- (near R34) DNP
- (near U20) DNP
- (near R35) DNP
- (near R115) DNP
- Title
- Variant
- Approved
- Date:
- Author:
- Size:
- A3
- Document Name
- Time:
- SVN Revision:
- Rel.
- Rev.
- Sheet
- of

### Library data of the parts
C20 C26 = 100nF_Dup1: NB Not Fitted; code_DK: 490-10430-1-ND; Voltage: 50V; Tolerance: 5%; Part Type: capacitor\ceramic
C21 C24 C25 C31 C33-C35 C41 = 100nF_Dup1: code_DK: 490-10430-1-ND; Voltage: 50V; Tolerance: 5%; Part Type: capacitor\ceramic
C22 = 3.9nF: Voltage: 50V; Tolerance: 5%; Temperature coefficient: COG/NPO; Part Type: capacitor\ceramic
C23 = 68nF: Temperature coefficient: X7R; Tolerance: 10%; Voltage: 50V; Part Type: capacitor\ceramic
C27 C29 C42 = 10pF: 10pF  ±1%  50V  NPO; code_DK: 490-7750-1-ND; Voltage: 50V; Part Type: capacitor\ceramic; Tolerance: 1%
C28 C30 C39 C40 = 1nF: as C14 on sheet 2 - Position2Go_Microcontroller; Part Type: capacitor\ceramic
C32 C43 = 10nF: Tolerance: 10%; Voltage: 10V; code_DK: 490-7223-1-ND; Part Type: capacitor\ceramic
C36 C45 C46 = 10UF: Temperature coefficient: X5R; Tolerance: 20%; Voltage: 10V; code_DK: 1276-1450-1-ND; Part Type: capacitor\ceramic
C37 C38 = 100pF: 150pF  ±5%  25V  NPO; code_DK: 587-3799-1-ND; Tolerance: 5%; Part Type: capacitor\ceramic; Voltage: 25V
CU1 = WILKINSON: Preis: 0.0; FootprintBOM: -
CU50 = 48GHz_Filter: Preis: 0.0; FootprintBOM: -
Q1 = IRLHS2242: code_DK: IRLHS2242TRPBFCT-ND
R20 R29 R31 R35 R115 = 0_Dup2: NB Not Fitted; code_DK: 311-0.0NCT-ND; tolerance: 1%; Power: 0.063W; size: 0201
R21 R28 R129 R130 = 0_Dup2: as R47 on sheet 2 - Position2Go_Microcontroller; size: 0201
R22 R26 R27 R39-R41 = 1: Power: 0.063W; tolerance: 1%; code_DK: YAG3368CT-ND; size: 0201
R23 = 0_Dup1: Power: 0.063W; tolerance: 5%; size: 0402
R24 R34 = 100: NB Not Fitted; code_DK: 311-100MCT-ND; tolerance: 1%; Power: 0.063W; size: 0201
R25 = 20: Power: 0.063W; tolerance: 1%; size: 0402
R30 R33 R37 R44 R132 = 100: as R11 on sheet 2 - Position2Go_Microcontroller; size: 0201
R32 R43 = 51: code_DK: YAG2288CT-ND; tolerance: 1%; Power: 0.063W; size: 0201
R38 = 10: code_DK: 541-10.0ABCT-ND; tolerance: 1%; Power: 0.063W; size: 0201
R45 R46 = 150: tolerance: 1%; Power: 0.063W; size: 0201
R116 R118 R131 = 10K_Dup1: as R3 on sheet 2 - Position2Go_Microcontroller; size: 0201
R122 = 0: 0R 0603; code_DK: MCT0603-0.0-ZZDKR-ND; tolerance: 1%; Power: 0.125W; size: 0603
R_MOD = WILKINSON_0402: Resistor; Manufacturer: Multicomp; Bestellnummer: 9330364; Preis: 0.007; FootprintBOM: 0402; Link: http://de.farnell.com/multicomp/mc0063w06031100r/widerstand-100r-0-063w-1-0603/dp/9330364
U5 = BGT24ATR12: code_DK: BGT24MTR12E6327XUMA1CT-ND
U6 U20 = TS5A23166_DSBGA: NB Not Fitted; code_DK: 296-21183-1-ND
U7 = LMX2491: IsHeterogeneous: False; DevicesInView: 1; DeviceDesignator: A; DeviceNumbering: Alpha; OriginalSymbolOrigin: (30000,20000); code_DK: 296-45092-1-ND; DevicesInPackage: 1
U21 = K3525_40MHz: code_DK: 1253-1412-1-ND
U23 = LP5912_3_3V: code_DK: 296-44153-1-ND

## Sheet 4 - Position2Go_Baseband.SchDoc
size A3; Release: RC00; PageSetup: Record=PageOptions|CenterHorizontal=True|CenterVertical=True|PrintScale=1.01|XCorrection=1.00|YCorrection=1.00|PrintKind=0|BorderSize=5000000|LeftOffset=0|BottomOffset=0|Orientation=2|PaperLength=1000|PaperWidth=1000|Scale=100|PaperSource=7|PrintQuality=-4|MediaType=1|DitherType=10|PaperKind=A3|PrintScaleMode=1; Doc_ConfidentialStatus: <Doc_ConfidentialStatus>; Doc_Preliminary: <Doc_Preliminary>
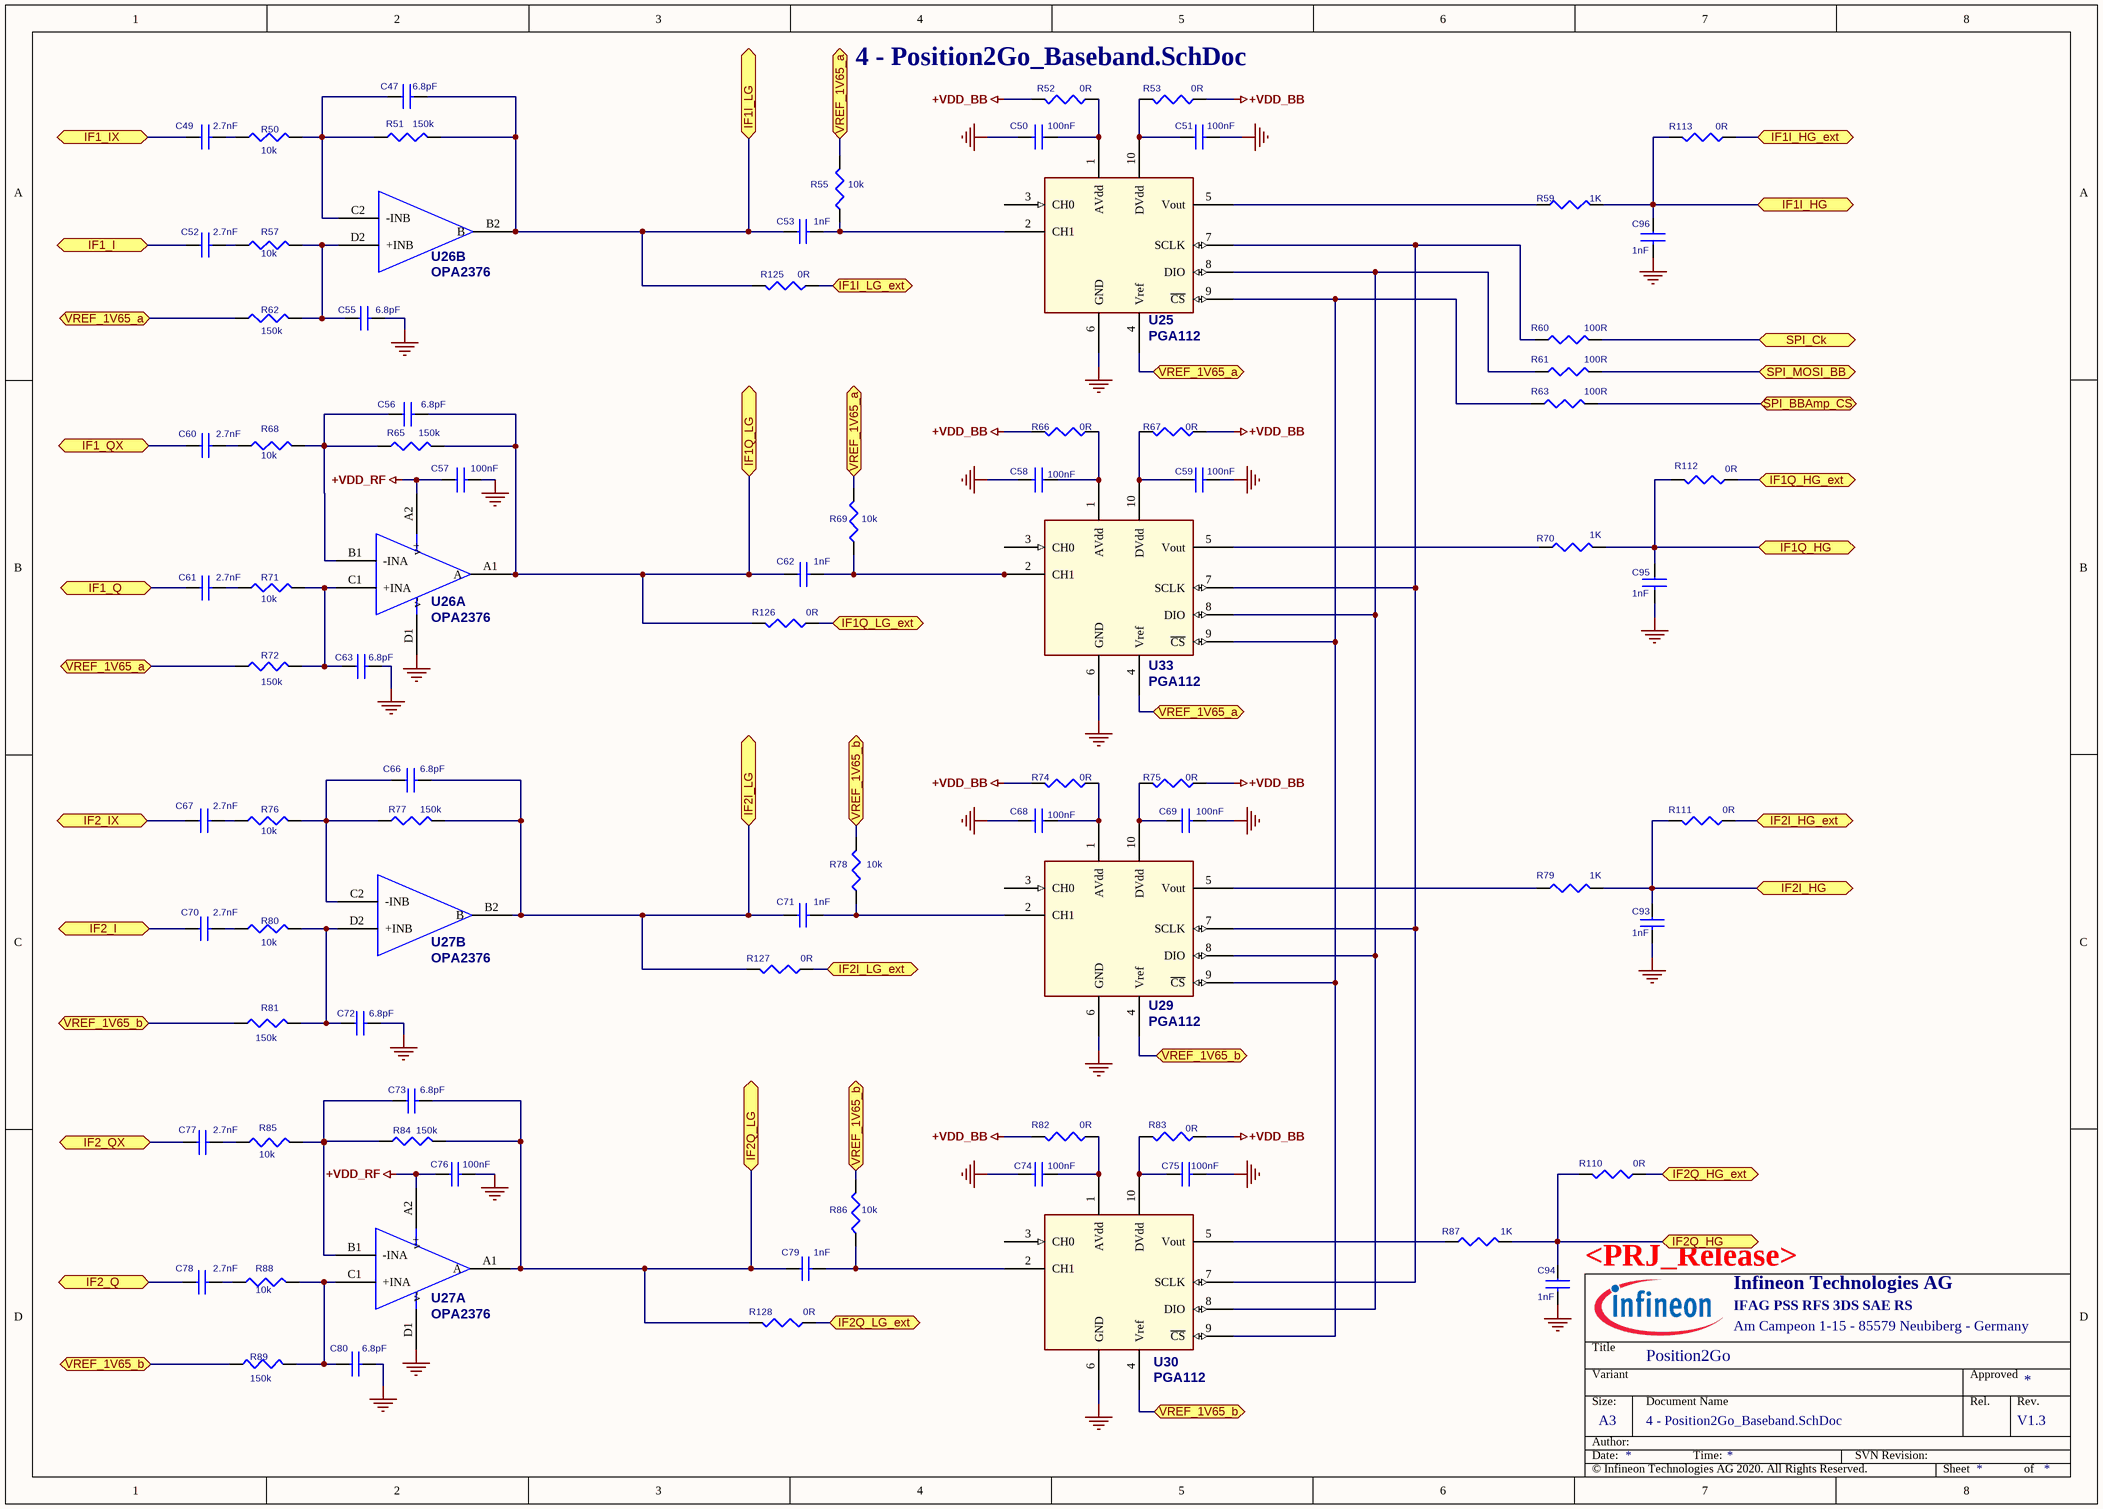
[diagram p3: 4 - Position2Go_Baseband.SchDoc]

### Parts
C47  6.8pF  [C_0201]
C49  2.7nF  [1206_40h]
C50  100nF  [C_0201]
C51  100nF  [C_0201]
C52  2.7nF  [1206_40h]
C53  1nF  [1206_40h]
C55  6.8pF  [C_0201]
C56  6.8pF  [C_0201]
C57  100nF  [C_0201]
C58  100nF  [C_0201]
C59  100nF  [C_0201]
C60  2.7nF  [1206_40h]
C61  2.7nF  [1206_40h]
C62  1nF  [1206_40h]
C63  6.8pF  [C_0201]
C66  6.8pF  [C_0201]
C67  2.7nF  [1206_40h]
C68  100nF  [C_0201]
C69  100nF  [C_0201]
C70  2.7nF  [1206_40h]
C71  1nF  [1206_40h]
C72  6.8pF  [C_0201]
C73  6.8pF  [C_0201]
C74  100nF  [C_0201]
C75  100nF  [C_0201]
C76  100nF  [C_0201]
C77  2.7nF  [1206_40h]
C78  2.7nF  [1206_40h]
C79  1nF  [1206_40h]
C80  6.8pF  [C_0201]
C93  1nF  [C_0201]
C94  1nF  [C_0201]
C95  1nF  [C_0201]
C96  1nF  [C_0201]
R50  10k  [R_0201]
R51  150k  [R_0201]
R52  0R  [R_0201]
R53  0R  [R_0201]
R55  10k  [R_0201]
R57  10k  [R_0201]
R59  1K  [R_0201]
R60  100R  [R_0201]
R61  100R  [R_0201]
R62  150k  [R_0201]
R63  100R  [R_0201]
R65  150k  [R_0201]
R66  0R  [R_0201]
R67  0R  [R_0201]
R68  10k  [R_0201]
R69  10k  [R_0201]
R70  1K  [R_0201]
R71  10k  [R_0201]
R72  150k  [R_0201]
R74  0R  [R_0201]
R75  0R  [R_0201]
R76  10k  [R_0201]
R77  150k  [R_0201]
R78  10k  [R_0201]
R79  1K  [R_0201]
R80  10k  [R_0201]
R81  150k  [R_0201]
R82  0R  [R_0201]
R83  0R  [R_0201]
R84  150k  [R_0201]
R85  10k  [R_0201]
R86  10k  [R_0201]
R87  1K  [R_0201]
R88  10k  [R_0201]
R89  150k  [R_0201]
R110  0R  [R_0201]
R111  0R  [R_0201]
R112  0R  [R_0201]
R113  0R  [R_0201]
R125  0R  [R_0201]
R126  0R  [R_0201]
R127  0R  [R_0201]
R128  0R  [R_0201]
U25  PGA112  [DGS0010A_M]
U26  OPA2376  [OPA2376_DSBGA]  (parts A,B of 2)
U27  OPA2376  [OPA2376_DSBGA]  (parts A,B of 2)
U29  PGA112  [DGS0010A_M]
U30  PGA112  [DGS0010A_M]
U33  PGA112  [DGS0010A_M]

### Ports
IF1_I (bidir), IF1_IX (bidir), IF1_Q (bidir), IF1_QX (bidir), IF1I_HG (bidir), IF1I_HG_ext (bidir), IF1I_LG (bidir), IF1I_LG_ext (bidir), IF1Q_HG (bidir), IF1Q_HG_ext (bidir), IF1Q_LG (bidir), IF1Q_LG_ext (bidir), IF2_I (bidir), IF2_IX (bidir), IF2_Q (bidir), IF2_QX (bidir), IF2I_HG (bidir), IF2I_HG_ext (bidir), IF2I_LG (bidir), IF2I_LG_ext (bidir), IF2Q_HG (bidir), IF2Q_HG_ext (bidir), IF2Q_LG (bidir), IF2Q_LG_ext (bidir), SPI_BBAmp_CS (bidir), SPI_Ck (bidir), SPI_MOSI_BB (bidir), VREF_1V65_a (bidir), VREF_1V65_b (bidir)

### Nets
+VDD_BB: R52.2 R53.2 R66.2 R67.2 R74.2 R75.2 R82.2 R83.2
+VDD_RF: C57.1 C76.1 U26.A2(v+) U27.A2(v+)
GND_POWER: C50.2 C51.2 C55.2 C57.2 C58.2 C59.2 C63.2 C68.2 C69.2 C72.2 C74.2 C75.2 C76.2 C80.2 C93.2 C94.2 C95.2 C96.2 U25.6(GND) U26.D1(v-) U27.D1(v-) U29.6(GND) U30.6(GND) U33.6(GND)
NetC47_1: C47.1 R50.2 R51.1 U26.C2(-INB)
NetC47_2: C47.2 C53.1 R51.2 R125.2 U26.B2(B) ; port IF1I_LG
NetC49_1: C49.1 ; port IF1_IX
NetC49_2: C49.2 R50.1
NetC50_1: C50.1 R52.1 U25.1(AVdd)
NetC51_1: C51.1 R53.1 U25.10(DVdd)
NetC52_1: C52.1 ; port IF1_I
NetC52_2: C52.2 R57.1
NetC53_2: C53.2 R55.1 U25.2(CH1)
NetC55_1: C55.1 R57.2 R62.1 U26.D2(+INB)
NetC56_1: C56.1 R65.1 R68.2 U26.B1(-INA)
NetC56_2: C56.2 C62.1 R65.2 R126.2 U26.A1(A) ; port IF1Q_LG
NetC58_1: C58.1 R66.1 U33.1(AVdd)
NetC59_1: C59.1 R67.1 U33.10(DVdd)
NetC60_1: C60.1 ; port IF1_QX
NetC60_2: C60.2 R68.1
NetC61_1: C61.1 ; port IF1_Q
NetC61_2: C61.2 R71.1
NetC62_2: C62.2 R69.1 U33.2(CH1)
NetC63_1: C63.1 R71.2 R72.1 U26.C1(+INA)
NetC66_1: C66.1 R76.2 R77.1 U27.C2(-INB)
NetC66_2: C66.2 C71.1 R77.2 R127.2 U27.B2(B) ; port IF2I_LG
NetC67_1: C67.1 ; port IF2_IX
NetC67_2: C67.2 R76.1
NetC68_1: C68.1 R74.1 U29.1(AVdd)
NetC69_1: C69.1 R75.1 U29.10(DVdd)
NetC70_1: C70.1 ; port IF2_I
NetC70_2: C70.2 R80.1
NetC71_2: C71.2 R78.1 U29.2(CH1)
NetC72_1: C72.1 R80.2 R81.1 U27.D2(+INB)
NetC73_1: C73.1 R84.1 R85.2 U27.B1(-INA)
NetC73_2: C73.2 C79.1 R84.2 R128.2 U27.A1(A) ; port IF2Q_LG
NetC74_1: C74.1 R82.1 U30.1(AVdd)
NetC75_1: C75.1 R83.1 U30.10(DVdd)
NetC77_1: C77.1 ; port IF2_QX
NetC77_2: C77.2 R85.1
NetC78_1: C78.1 ; port IF2_Q
NetC78_2: C78.2 R88.1
NetC79_2: C79.2 R86.1 U30.2(CH1)
NetC80_1: C80.1 R88.2 R89.1 U27.C1(+INA)
NetC93_1: C93.1 R79.2 R111.2 ; port IF2I_HG
NetC94_1: C94.1 R87.2 R110.2 ; port IF2Q_HG
NetC95_1: C95.1 R70.2 R112.2 ; port IF1Q_HG
NetC96_1: C96.1 R59.2 R113.2 ; port IF1I_HG
NetJ1_3: R60.2 ; port SPI_Ck
NetJ2_1: R127.1 ; port IF2I_LG_ext
NetJ2_2: R128.1 ; port IF2Q_LG_ext
NetJ2_7: R113.1 ; port IF1I_HG_ext
NetJ2_8: R112.1 ; port IF1Q_HG_ext
NetJ2_9: R111.1 ; port IF2I_HG_ext
NetJ2_10: R110.1 ; port IF2Q_HG_ext
NetJ2_12: R126.1 ; port IF1Q_LG_ext
NetJ2_13: R125.1 ; port IF1I_LG_ext
NetR55_2: R55.2 R62.2 R69.2 R72.2 U25.4(Vref) U33.4(Vref) ; port VREF_1V65_a
NetR59_1: R59.1 U25.5(Vout)
NetR60_1: R60.1 U25.7(SCLK) U29.7(SCLK) U30.7(SCLK) U33.7(SCLK)
NetR61_1: R61.1 U25.8(DIO) U29.8(DIO) U30.8(DIO) U33.8(DIO)
NetR61_2: R61.2 ; port SPI_MOSI_BB
NetR63_1: R63.1 U25.9(~{CS}) U29.9(~{CS}) U30.9(~{CS}) U33.9(~{CS})
NetR63_2: R63.2 ; port SPI_BBAmp_CS
NetR64_2: R78.2 R81.2 R86.2 R89.2 U29.4(Vref) U30.4(Vref) ; port VREF_1V65_b
NetR70_1: R70.1 U33.5(Vout)
NetR79_1: R79.1 U29.5(Vout)
NetR87_1: R87.1 U30.5(Vout)

Not connected (* = marked no-connect by the designer): U25 3(CH0); U29 3(CH0); U30 3(CH0); U33 3(CH0)

### Notes on the sheet
- Title
- Variant
- Approved
- Date:
- Author:
- Size:
- A3
- Document Name
- Time:
- SVN Revision:
- Rel.
- Rev.
- Sheet
- of

### Library data of the parts
C47 C55 C56 C63 C66 C72 C73 C80 = 15pF_Dup1: Tolerance: 0,5%; Voltage: 25V; Part Type: capacitor\ceramic
C49 C52 C53 C60-C62 C67 C70 C71 C77-C79 = 220uF: Voltage: 50V; Tolerance: 5%; Part Type: capacitor\ceramic
C50 C51 C57-C59 C68 C69 C74-C76 = 100nF_Dup1: as C21 on sheet 3 - Position2Go_RF_Section; Part Type: capacitor\ceramic
C93-C96 = 1nF: as C14 on sheet 2 - Position2Go_Microcontroller; Part Type: capacitor\ceramic
R50 R55 R57 R68 R69 R71 R76 R78 R80 R85 R86 R88 = 10K_Dup1: as R3 on sheet 2 - Position2Go_Microcontroller; size: 0201
R51 R62 R65 R72 R77 R81 R84 R89 = 100K: Power: 0.063W; tolerance: 1%; size: 0201
R52 R53 R66 R67 R74 R75 R82 R83 R110-R113 R125-R128 = 0_Dup2: as R47 on sheet 2 - Position2Go_Microcontroller; size: 0201
R59 R70 R79 R87 = 10: code_DK: 311-1KMCT-ND; tolerance: 1%; Power: 0.063W; size: 0201
R60 R61 R63 = 100: as R11 on sheet 2 - Position2Go_Microcontroller; size: 0201
U25 U29 U30 U33 = PGA112: code_DK: 296-23315-1-ND
U26 U27 = OPA2376_DSBGA_Dup1: code_DK: 296-39119-1-ND

## Sheet 5 - Position2Go_PowerSupply_and_Connectors.SchDoc
size A3; Release: RC00; PageSetup: Record=PageOptions|CenterHorizontal=True|CenterVertical=True|PrintScale=1.01|XCorrection=1.00|YCorrection=1.00|PrintKind=0|BorderSize=5000000|LeftOffset=0|BottomOffset=0|Orientation=2|PaperLength=1000|PaperWidth=1000|Scale=100|PaperSource=7|PrintQuality=-4|MediaType=1|DitherType=10|PaperKind=A3|PrintScaleMode=1; Doc_ConfidentialStatus: <Doc_ConfidentialStatus>; Doc_Preliminary: <Doc_Preliminary>
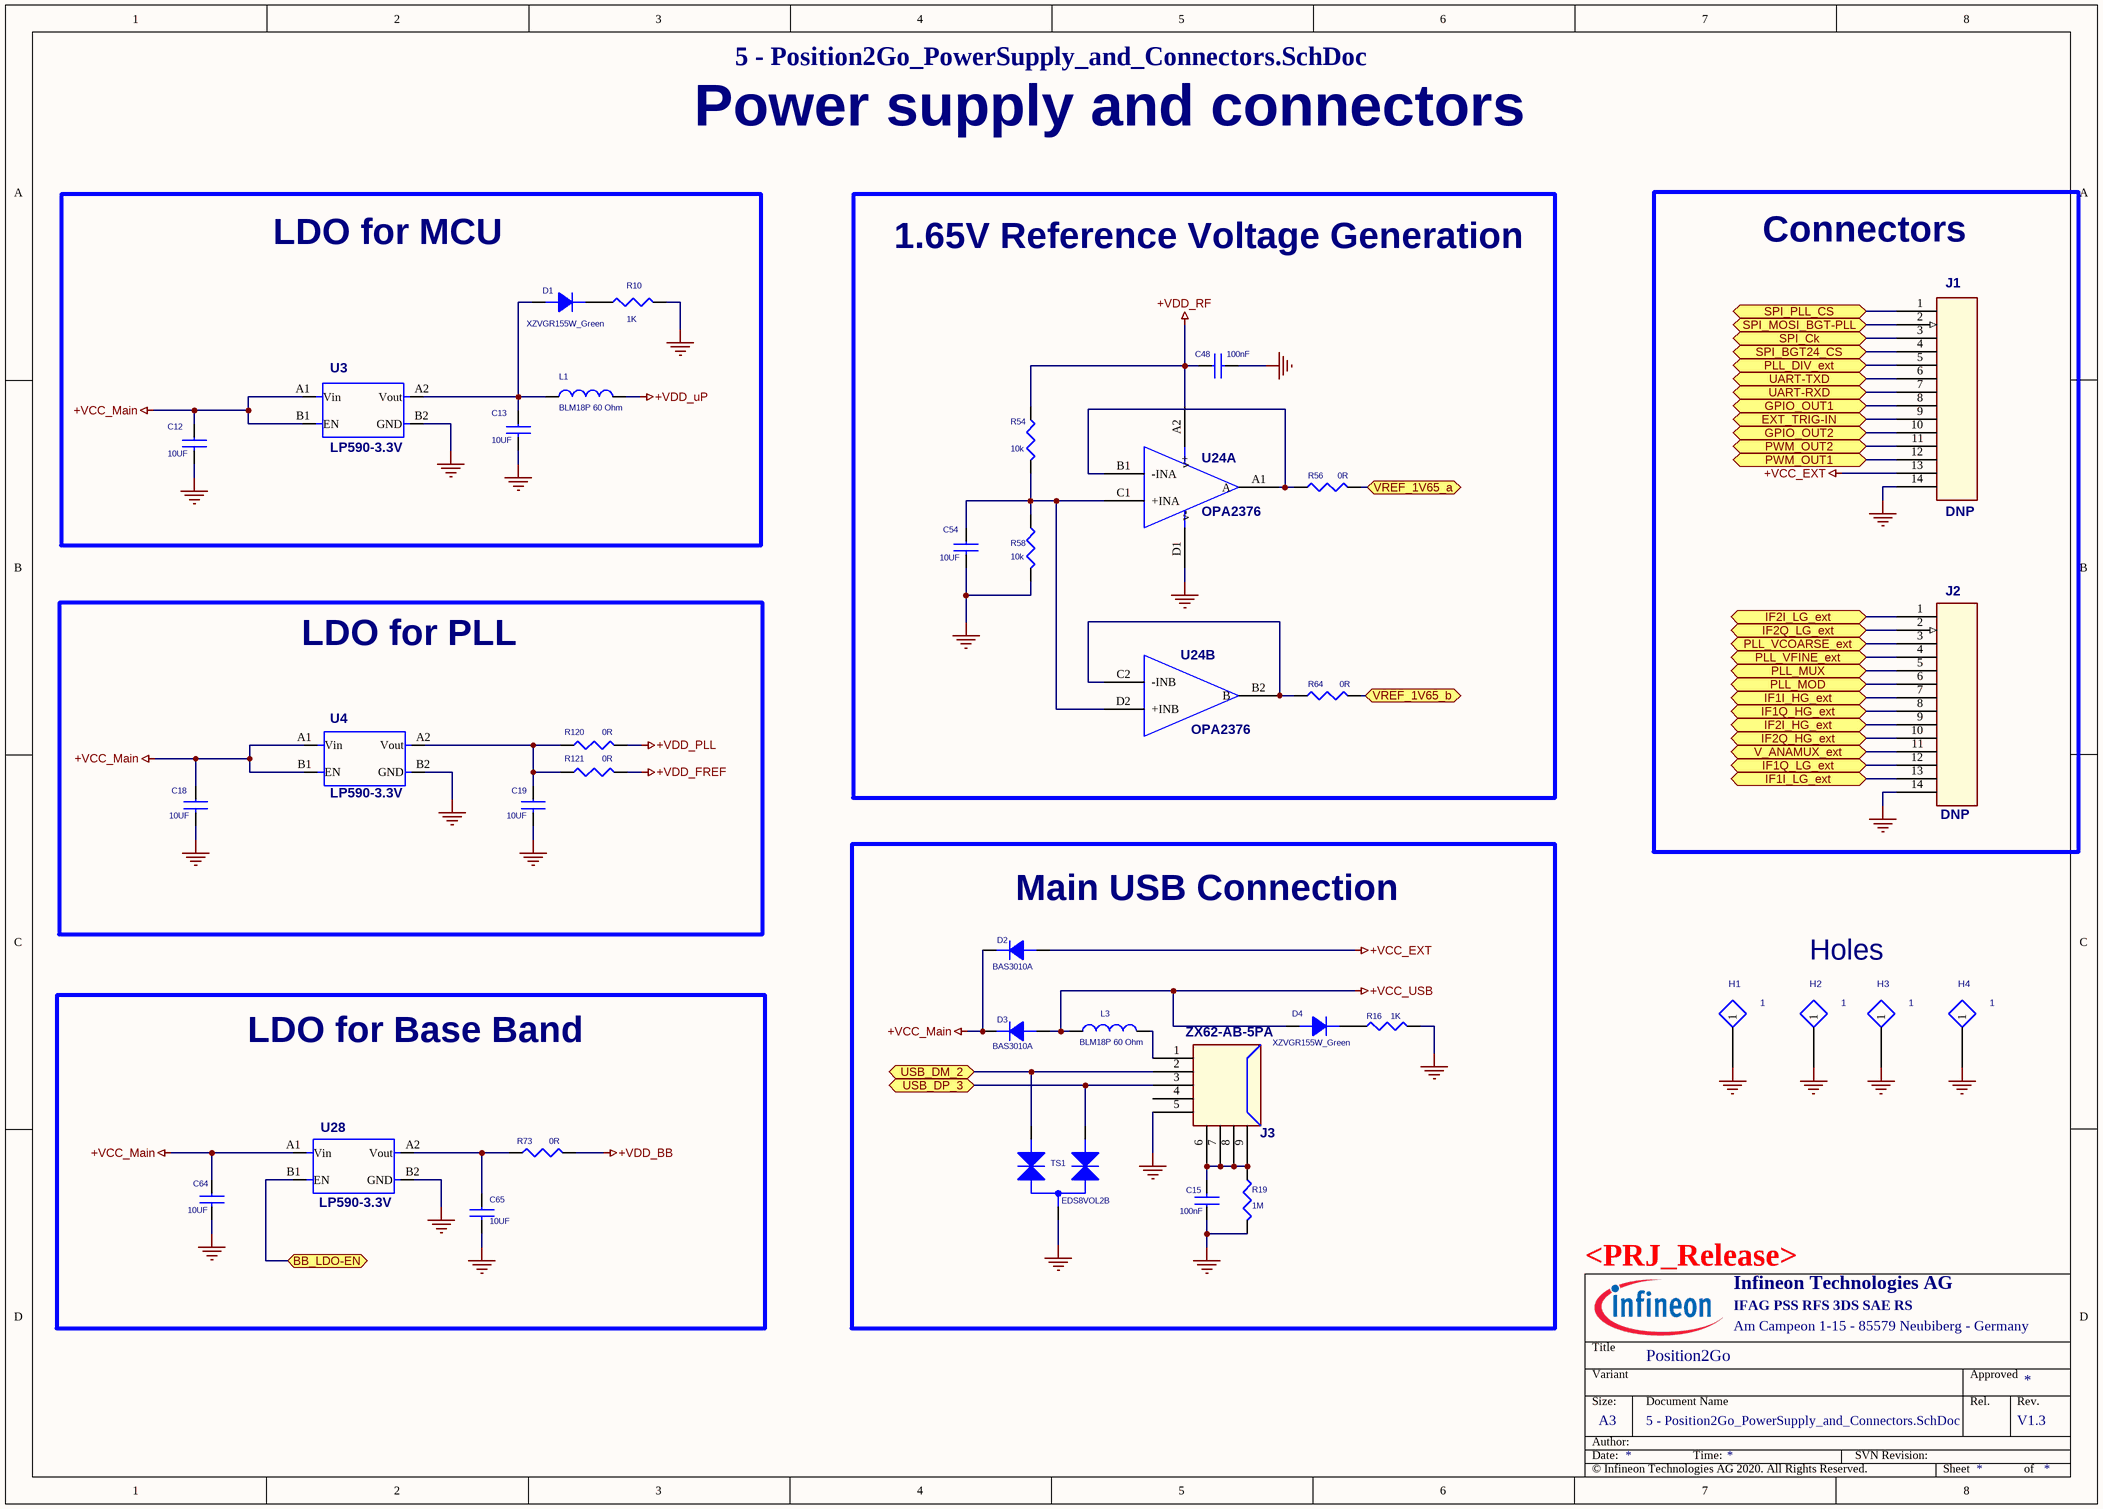
[diagram p4: 5 - Position2Go_PowerSupply_and_Connectors.SchDoc]

### Parts
C12  10UF  [0402_durac]
C13  10UF  [0402_durac]
C15  100nF  [0402_durac]
C18  10UF  [0402_durac]
C19  10UF  [0402_durac]
C48  100nF  [C_0201]
C54  10UF  [0402_durac]
C64  10UF  [0402_durac]
C65  10UF  [0402_durac]
D1  XZVGR155W_Green  [LED_0201]
D2  BAS3010A  [sod323]
D3  BAS3010A  [sod323]
D4  XZVGR155W_Green  [LED_0201]
H1  1  [vite_1mm]  (no BOM)
H2  1  [vite_1mm]  (no BOM)
H3  1  [vite_1mm]  (no BOM)
H4  1  [vite_1mm]  (no BOM)
J1  DNP  [conn_14_90deg_th]
J2  DNP  [conn_14_90deg_th]
J3  ZX62-AB-5PA  [micro_AB_ZX62]
L1  BLM18P 60 Ohm  [L_0603]
L3  BLM18P 60 Ohm  [L_0603]
R10  1K  [R_0201]
R16  1K  [R_0201]
R19  1M  [R_0201]
R54  10k  [R_0201]
R56  0R  [R_0201]
R58  10k  [R_0201]
R64  0R  [R_0201]
R73  0R  [0603]
R120  0R  [0603]
R121  0R  [0603]
TS1  EDS8VOL2B  [ESD8VOL2B]
U3  LP590-3.3V  [YKE4]
U4  LP590-3.3V  [YKE4]
U24  OPA2376  [OPA2376_DSBGA]  (parts A,B of 2)
U28  LP590-3.3V  [YKE4]

### Blocks framed on the sheet
LDO for MCU: C12 C13 D1 L1 R10 U3
1.65V Reference Voltage Generation: C48 C54 R54 R56 R58 R64 U24
Connectors: J1 J2
LDO for PLL: C18 C19 R120 R121 U4
Main USB Connection: C15 D2-D4 J3 L3 R16 R19 TS1
LDO for Base Band: C64 C65 R73 U28

### Ports
BB_LDO-EN (bidir), EXT_TRIG-IN (bidir), GPIO_OUT1 (bidir), GPIO_OUT2 (bidir), IF1I_HG_ext (bidir), IF1I_LG_ext (bidir), IF1Q_HG_ext (bidir), IF1Q_LG_ext (bidir), IF2I_HG_ext (bidir), IF2I_LG_ext (bidir), IF2Q_HG_ext (bidir), IF2Q_LG_ext (bidir), PLL_DIV_ext (bidir), PLL_MOD (bidir), PLL_MUX (bidir), PLL_VCOARSE_ext (bidir), PLL_VFINE_ext (bidir), PWM_OUT1 (bidir), PWM_OUT2 (bidir), SPI_BGT24_CS (bidir), SPI_Ck (bidir), SPI_MOSI_BGT-PLL (bidir), SPI_PLL_CS (bidir), UART-RXD (bidir), UART-TXD (bidir), USB_DM_2 (bidir), USB_DP_3 (bidir), V_ANAMUX_ext (bidir), VREF_1V65_a (bidir), VREF_1V65_b (bidir)

### Nets
+VCC_EXT: D2.2(A) J1.13
+VCC_Main: C12.1 C18.1 C64.1 D2.1(K) D3.1(K) U3.A1(Vin) U3.B1(EN) U4.A1(Vin) U4.B1(EN) U28.A1(Vin)
+VCC_USB: D3.2(A) D4.2(A) L3.2
+VDD_BB: R73.1
+VDD_FREF: R121.2
+VDD_PLL: R120.2
+VDD_RF: C48.1 R54.1 U24.A2(v+)
+VDD_uP: L1.2
GND_POWER: C12.2 C13.2 C15.1 C18.2 C19.2 C48.2 C54.2 C64.2 C65.2 H1.1 H2.1 H3.1 H4.1 J1.14 J2.14 J3.5 R10.1 R16.1 R19.2 R58.2 TS1.3 U3.B2(GND) U4.B2(GND) U24.D1(v-) U28.B2(GND)
NetC13_1: C13.1 D1.2(A) L1.1 U3.A2(Vout)
NetC15_2: C15.2 J3.6(GND) J3.7(GND) J3.8(GND) J3.9(GNd) R19.1
NetC19_1: C19.1 R120.1 R121.1 U4.A2(Vout)
NetC54_1: C54.1 R54.2 R58.1 U24.C1(+INA) U24.D2(+INB)
NetC65_1: C65.1 R73.2 U28.A2(Vout)
NetD1_1: D1.1(K) R10.2
NetD4_1: D4.1(K) R16.2
NetJ1_1: J1.1 ; port SPI_PLL_CS
NetJ1_2: J1.2 ; port SPI_MOSI_BGT-PLL
NetJ1_3: J1.3 ; port SPI_Ck
NetJ1_4: J1.4 ; port SPI_BGT24_CS
NetJ1_5: J1.5 ; port PLL_DIV_ext
NetJ1_6: J1.6 ; port UART-TXD
NetJ1_7: J1.7 ; port UART-RXD
NetJ1_8: J1.8 ; port GPIO_OUT1
NetJ1_9: J1.9 ; port EXT_TRIG-IN
NetJ1_10: J1.10 ; port GPIO_OUT2
NetJ1_11: J1.11 ; port PWM_OUT2
NetJ1_12: J1.12 ; port PWM_OUT1
NetJ2_1: J2.1 ; port IF2I_LG_ext
NetJ2_2: J2.2 ; port IF2Q_LG_ext
NetJ2_3: J2.3 ; port PLL_VCOARSE_ext
NetJ2_4: J2.4 ; port PLL_VFINE_ext
NetJ2_5: J2.5 ; port PLL_MUX
NetJ2_6: J2.6 ; port PLL_MOD
NetJ2_7: J2.7 ; port IF1I_HG_ext
NetJ2_8: J2.8 ; port IF1Q_HG_ext
NetJ2_9: J2.9 ; port IF2I_HG_ext
NetJ2_10: J2.10 ; port IF2Q_HG_ext
NetJ2_11: J2.11 ; port V_ANAMUX_ext
NetJ2_12: J2.12 ; port IF1Q_LG_ext
NetJ2_13: J2.13 ; port IF1I_LG_ext
NetJ3_1: J3.1 L3.1
NetJ3_2: J3.2 TS1.1 ; port USB_DM_2
NetJ3_3: J3.3 TS1.2 ; port USB_DP_3
NetR55_2: R56.2 ; port VREF_1V65_a
NetR56_1: R56.1 U24.A1(A) U24.B1(-INA)
NetR64_1: R64.1 U24.B2(B) U24.C2(-INB)
NetR64_2: R64.2 ; port VREF_1V65_b
NetR119_1: U28.B1(EN) ; port BB_LDO-EN

Not connected (* = marked no-connect by the designer): J3 4

### Notes on the sheet
- Power supply and connectors
- Holes
- Title
- Variant
- Approved
- Date:
- Author:
- Size:
- A3
- Document Name
- Time:
- SVN Revision:
- Rel.
- Rev.
- Sheet
- of

### Library data of the parts
C12 C13 C18 C19 C54 C64 C65 = 10UF: as C36 on sheet 3 - Position2Go_RF_Section; Part Type: capacitor\ceramic
  C13: Value: 10uF
C15 = CAP NP: 100nF  ±5%  16V  X7R; code_DK: 490-6327-1-ND
C48 = 100nF_Dup1: as C21 on sheet 3 - Position2Go_RF_Section; Part Type: capacitor\ceramic
D1 D4 = LED_0201_GREEN: as D8 on sheet 2 - Position2Go_Microcontroller
D2 D3 = BAS3010A: code_DK: BAS3010A-03WE6327INCT-ND
H1-H4 = vite_1mm: code_DK: N_M
J1 J2 = 14pos_TH_90_singola_fila: NB Not Fitted; code_DK: 732-5344-ND
J3 = CON_MICRO_AB: code_DK: H11580TR-ND
L1 L3 = blm18 p 60 ohm: code_DK: 490-1036-1-ND
R10 R16 = 1K: as R114 on sheet 2 - Position2Go_Microcontroller; size: 0201
R19 = 1M: Power: 0.063W; tolerance: 1%; code_DK: 311-1MMCT-ND; size: 0201
R54 R58 = 10K_Dup1: as R3 on sheet 2 - Position2Go_Microcontroller; size: 0201
R56 R64 = 0_Dup2: as R47 on sheet 2 - Position2Go_Microcontroller; size: 0201
R73 R120 R121 = 0: as R122 on sheet 3 - Position2Go_RF_Section; size: 0603
TS1 = ESD8VOL2B: code_DK: ESD8V0L2B-03LE6327INCT-ND
U3 U4 U28 = LP5907_BGA: code_DK: 296-35104-1-ND; OriginalSymbolOrigin: (20000,20000); DeviceNumbering: Alpha; DeviceDesignator: A; DevicesInPackage: 1; IsHeterogeneous: False; DevicesInView: 1
U24 = OPA2376_DSBGA: code_DK: 296-39119-1-ND

## Sheet 6 - Position2Go_Debugger.SchDoc
size A3; Release: RC00; PageSetup: Record=PageOptions|CenterHorizontal=True|CenterVertical=True|PrintScale=1.01|XCorrection=1.00|YCorrection=1.00|PrintKind=0|BorderSize=5000000|LeftOffset=0|BottomOffset=0|Orientation=2|PaperLength=1000|PaperWidth=1000|Scale=100|PaperSource=7|PrintQuality=-4|MediaType=1|DitherType=10|PaperKind=A3|PrintScaleMode=1; Doc_ConfidentialStatus: <Doc_ConfidentialStatus>; Doc_Preliminary: <Doc_Preliminary>
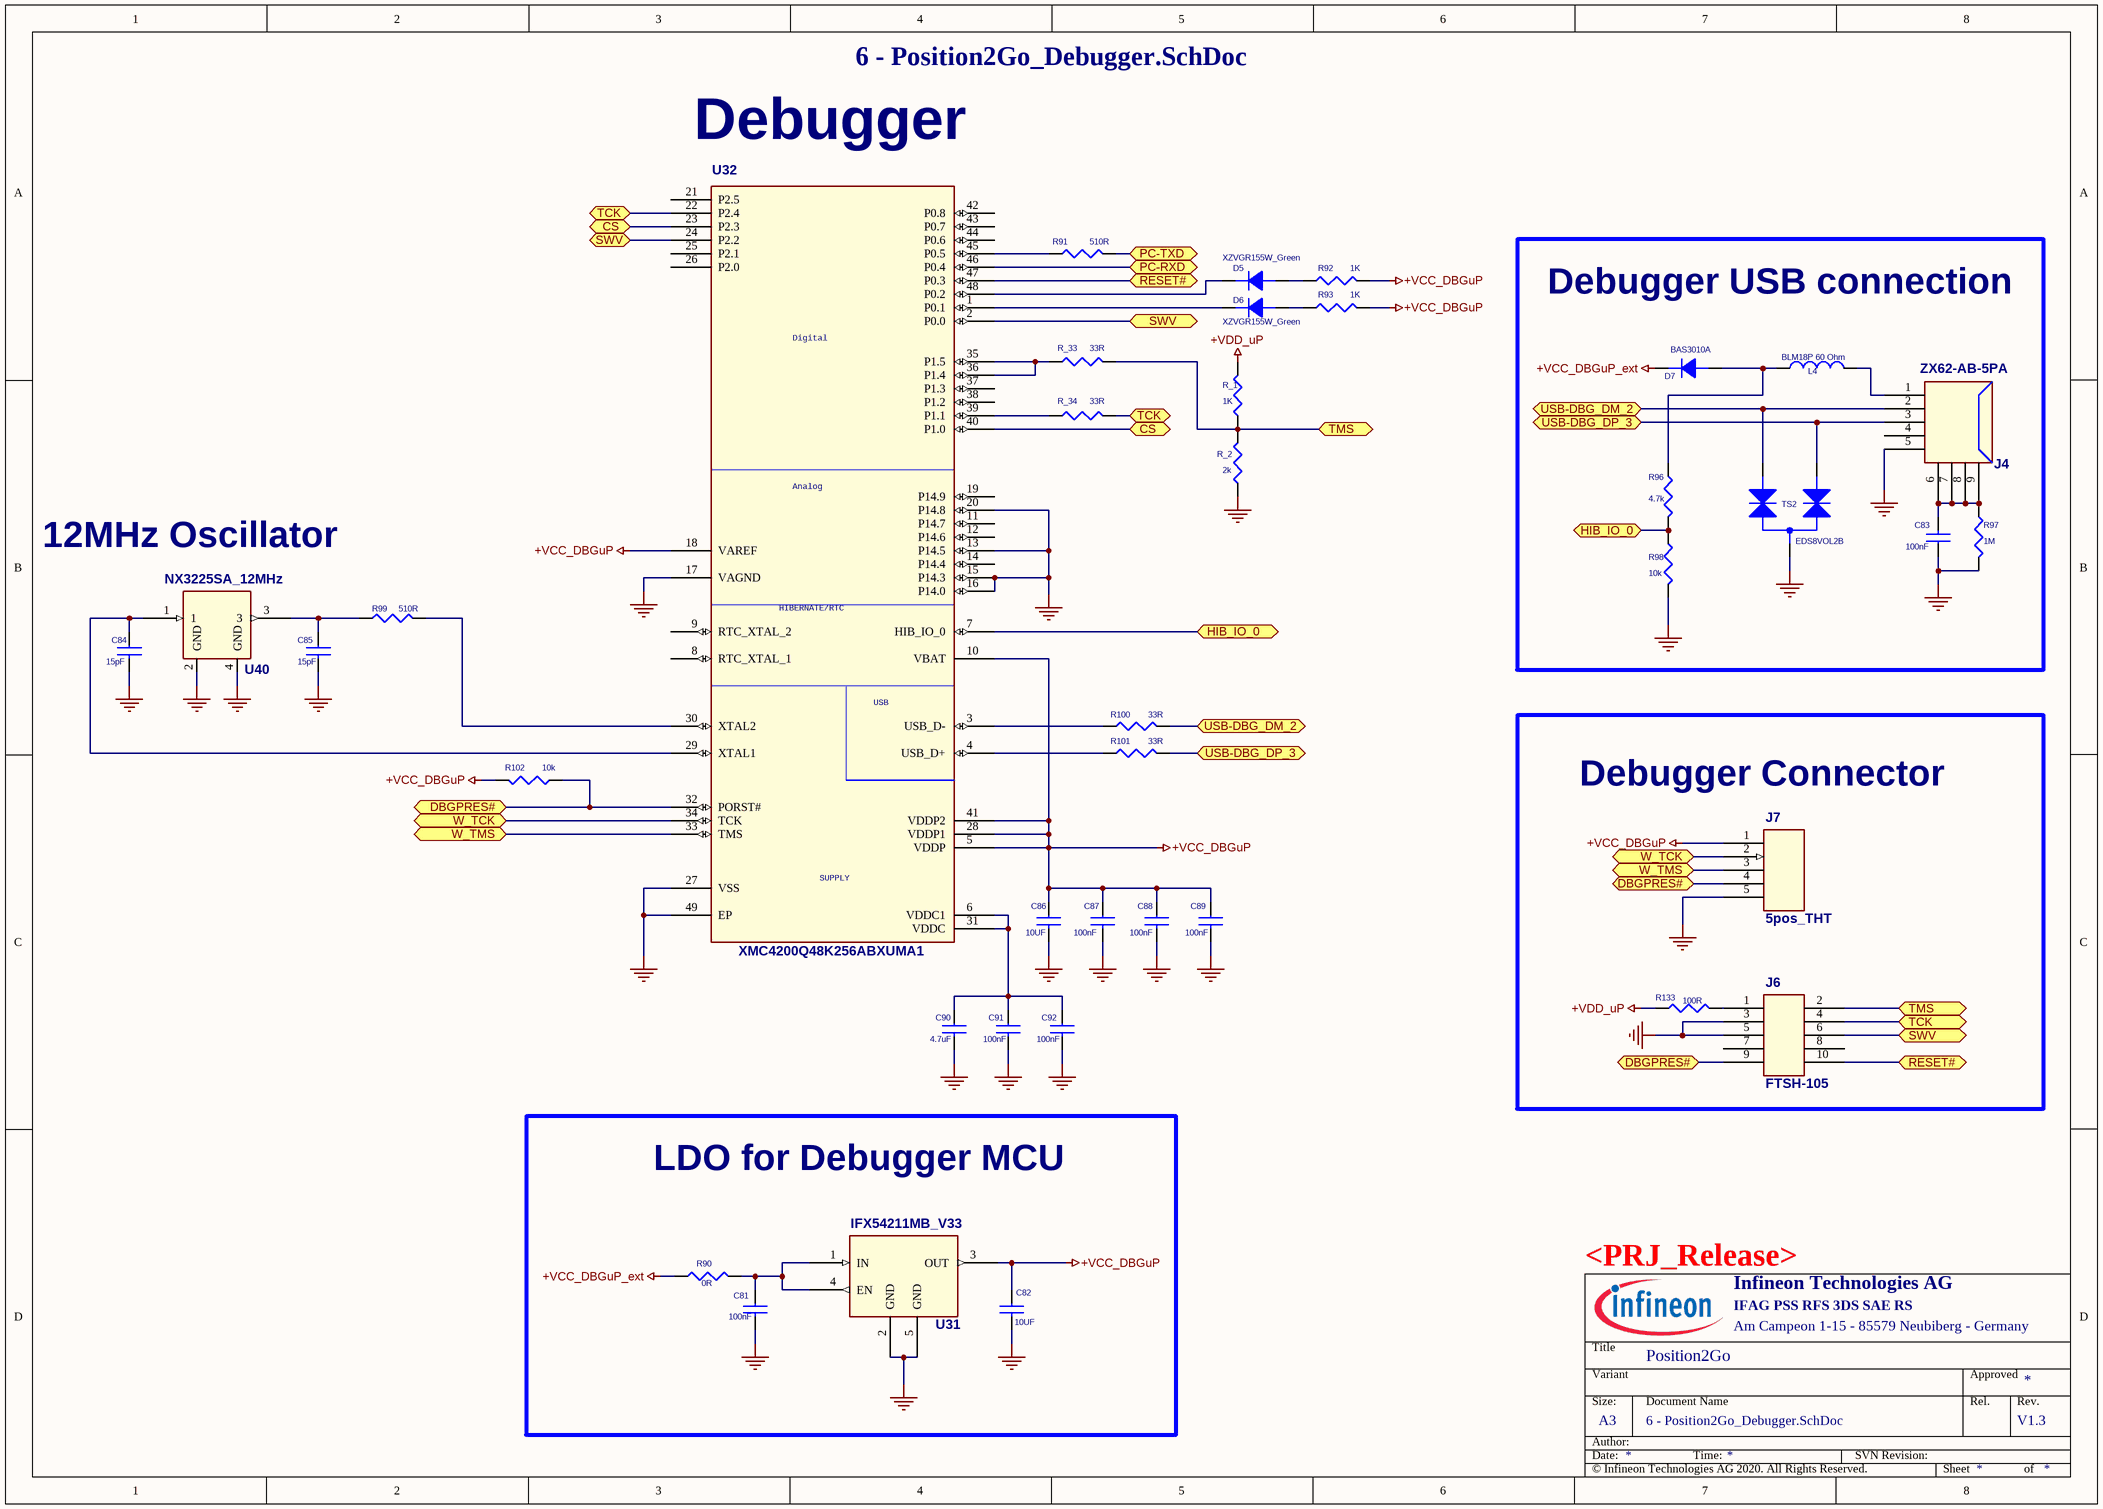
[diagram p5: 6 - Position2Go_Debugger.SchDoc]

### Parts
C81  100nF  [0402_durac]
C82  10UF  [0402_durac]
C83  100nF  [0402_durac]
C84  15pF  [0402_durac]
C85  15pF  [0402_durac]
C86  10UF  [0402_durac]
C87  100nF  [0402_durac]
C88  100nF  [0402_durac]
C89  100nF  [0402_durac]
C90  4.7uF  [0402_durac]
C91  100nF  [0402_durac]
C92  100nF  [0402_durac]
D5  XZVGR155W_Green  [LED_0201]
D6  XZVGR155W_Green  [LED_0201]
D7  BAS3010A  [sod323]
J4  ZX62-AB-5PA  [micro_AB_ZX62]
J6  FTSH-105  [CON_10_pin_uP_FTSH]
J7  5pos_THT  [con_5pin_254p]
L4  BLM18P 60 Ohm  [L_0603]
R90  0R  [0402_durac]
R91  510R  [0402_durac]
R92  1K  [R_0201]
R93  1K  [R_0201]
R96  4.7k  [0402_durac]
R97  1M  [0402_durac]
R98  10k  [0402_durac]
R99  510R  [0402_durac]
R100  33R  [0402_durac]
R101  33R  [0402_durac]
R102  10k  [0402_durac]
R133  100R  [0402_durac]
R_1  1K  [R_0201]
R_2  2k  [R_0201]
R_33  33R  [R_0201]
R_34  33R  [R_0201]
TS2  EDS8VOL2B  [ESD8VOL2B]
U31  IFX54211MB_V33  [inf-pg-sct595v]
U32  XMC4200Q48K256ABXUMA1  [inf-pg-vqfn-48-_-5200x5200tp_n]
U40  NX3225SA_12MHz  [NX3225SA]

### Blocks framed on the sheet
Debugger USB connection: C83 D7 J4 L4 R96-R98 TS2
Debugger Connector: J6 J7 R133
LDO for Debugger MCU: C81 C82 R90 U31

### Ports
CS (bidir), DBGPRES# (bidir), HIB_IO_0 (bidir), PC-RXD (bidir), PC-TXD (bidir), RESET# (bidir), SWV (bidir), TCK (bidir), TMS (bidir), USB-DBG_DM_2 (bidir), USB-DBG_DP_3 (bidir), W_TCK (bidir), W_TMS (bidir)

### Nets
+VCC_DBGuP: C82.1 C86.1 C87.1 C88.1 C89.1 J7.1 R92.2 R93.2 R102.2 U31.3(OUT) U32.5(VDDP) U32.10(VBAT) U32.18(VAREF) U32.28(VDDP1) U32.41(VDDP2)
+VCC_DBGuP_ext: D7.1(K) R90.1
+VDD_uP: R133.2 R_1.2
GND_POWER: C81.2 C82.2 C83.1 C84.2 C85.2 C86.2 C87.2 C88.2 C89.2 C90.2 C91.2 C92.2 J4.5 J6.3 J6.5 J7.5 R97.2 R98.2 R_2.1 TS2.3 U31.2(GND) U31.5(GND) U32.13(P14.5) U32.15(P14.3) U32.16(P14.0) U32.17(VAGND) U32.20(P14.8) U32.27(VSS) U32.49(EP) U40.2(GND) U40.4(GND)
NetC81_1: C81.1 R90.2 U31.1(IN) U31.4(EN)
NetC83_2: C83.2 J4.6(GND) J4.7(GND) J4.8(GND) J4.9(GNd) R97.1
NetC84_1: C84.1 U32.29(XTAL1) U40.1
NetC85_1: C85.1 R99.1 U40.3
NetC90_1: C90.1 C91.1 C92.1 U32.6(VDDC1) U32.31(VDDC)
NetD5_1: D5.1(K) U32.48(P0.2)
NetD5_2: D5.2(A) R92.1
NetD6_1: D6.1(K) U32.1(P0.1)
NetD6_2: D6.2(A) R93.1
NetD7_2: D7.2(A) L4.2 R96.1
NetJ4_1: J4.1 L4.1
NetJ4_2: J4.2 R100.2 TS2.1 ; port USB-DBG_DM_2
NetJ4_3: J4.3 R101.2 TS2.2 ; port USB-DBG_DP_3
NetJ6_1: J6.1 R133.1
NetJ6_2: J6.2 R_1.1 R_2.2 R_33.2 ; port TMS
NetJ6_4: J6.4 R_34.2 U32.22(P2.4) ; port TCK
NetJ6_6: J6.6 U32.2(P0.0) U32.24(P2.2) ; port SWV
NetJ6_9: J6.9 J7.4 R102.1 U32.32(PORST#) ; port DBGPRES#
NetJ6_10: J6.10 U32.47(P0.3) ; port RESET#
NetJ7_2: J7.2 U32.34(TCK) ; port W_TCK
NetJ7_3: J7.3 U32.33(TMS) ; port W_TMS
NetR91_1: R91.1 U32.45(P0.5)
NetR91_2: R91.2 ; port PC-TXD
NetR96_2: R96.2 R98.1 U32.7(HIB_IO_0) ; port HIB_IO_0
NetR99_2: R99.2 U32.30(XTAL2)
NetR100_1: R100.1 U32.3(USB_D-)
NetR101_1: R101.1 U32.4(USB_D+)
NetR134_2: U32.46(P0.4) ; port PC-RXD
NetR_33_1: R_33.1 U32.35(P1.5) U32.36(P1.4)
NetR_34_1: R_34.1 U32.39(P1.1)
NetU32_23: U32.23(P2.3) U32.40(P1.0) ; port CS

Not connected (* = marked no-connect by the designer): J4 4; J6 7 8; U32 8(RTC_XTAL_1) 9(RTC_XTAL_2) 11(P14.7) 12(P14.6) 14(P14.4) 19(P14.9) 21(P2.5) 25(P2.1) 26(P2.0) 37(P1.3) 38(P1.2) 42(P0.8) 43(P0.7) 44(P0.6)

### Notes on the sheet
- (near U32) Debugger
- 12MHz Oscillator
- Title
- Variant
- Approved
- Date:
- Author:
- Size:
- A3
- Document Name
- Time:
- SVN Revision:
- Rel.
- Rev.
- Sheet
- of
- (in symbol XMC4200_VQFN48) Digital; Analog; HIBERNATE/RTC; USB; SUPPLY

### Library data of the parts
C81 C87-C89 C91 C92 = 100nF: 100nF  ±5%  16V  X7R; code_DK: 490-6327-2-ND; Temperature coefficient: X7R; Tolerance: 5%; Part Type: capacitor\ceramic; Voltage: 16V
C82 C86 = 10UF: as C36 on sheet 3 - Position2Go_RF_Section; Part Type: capacitor\ceramic
C83 = CAP NP: as C15 on sheet 5 - Position2Go_PowerSupply_and_Connectors
C84 C85 = 15pF: Temperature coefficient: NP0; Tolerance: +-0.1pF; Voltage: 50V; code_DK: 490-6200-1-ND; code_DK_Reel: 490-6212-6-ND; Part Type: capacitor\ceramic
C90 = 4.7UF: as C9 on sheet 2 - Position2Go_Microcontroller; Part Type: capacitor\ceramic
D5 D6 = LED_0201_GREEN: as D8 on sheet 2 - Position2Go_Microcontroller
D7 = BAS3010A: code_DK: BAS3010A-03WE6327INCT-ND
J4 = CON_MICRO_AB: code_DK: H11580TR-ND
J6 = CON_10_pin_uP_FTSH: code_DK: SAM8799-ND
J7 = 5pos_TH_passo2_54: code_DK: 732-5318-ND
L4 = blm18 p 60 ohm: code_DK: 490-1036-1-ND
R90 = 0_Dup1: 04 0402; Power: 0.063W; tolerance: 1%; code_DK: 311-0.0JRTR-ND; size: 0402
R91 R99 = 510: as R134 on sheet 2 - Position2Go_Microcontroller; size: 0402
R92 R93 R_1 = 1K: as R114 on sheet 2 - Position2Go_Microcontroller; size: 0201
R96 = 4.7K: code_DK: 311-4.7KLRTR-ND; tolerance: 1%; Power: 0.063W; size: 0402
R97 = RESISTOR: code_DK: 311-1.00MLRTR-ND
R98 R102 = 10K: code_DK: 311-10.0KLRTR-ND; tolerance: 1%; Power: 0.063W; size: 0402
R100 R101 = 33: Power: 0.063W; tolerance: 1%; code_DK: 311-33.0LRTR-ND; size: 0402
R133 = RESISTOR: code_DK: 311-100LRTR-ND
R_2 R_33 R_34 = 1K: Power: 0.063W; tolerance: 1%; size: 0201
TS2 = ESD8VOL2B: code_DK: ESD8V0L2B-03LE6327INCT-ND
U31 = IFX54211MB_V33: code_DK: NN; code_MO: 726-IFX54211MBV33HTM
U32 = XMC4200_VQFN48: code_DK: XMC4200Q48K256ABXUMA1CT-ND
U40 = NX3225SA_12MHZ: NX3225SA-12.000M-STD-CRS-2; code_DK: 644-1128-2-ND; Manufacturer Part Number: NX3225SA-12.000M-STD-CRS-2

## Nets that join several sheets
+VCC_Main: 3 - Position2Go_RF_Section (C45.1 U23.6), 5 - Position2Go_PowerSupply_and_Connectors (10 pins)
+VCC_USB: 2 - Position2Go_Microcontroller (U1.G2), 5 - Position2Go_PowerSupply_and_Connectors (D3.2 D4.2 L3.2)
+VDD_BB: 4 - Position2Go_Baseband (8 pins), 5 - Position2Go_PowerSupply_and_Connectors (R73.1)
+VDD_FREF: 3 - Position2Go_RF_Section (C41.1 R44.2 U21.4), 5 - Position2Go_PowerSupply_and_Connectors (R121.2)
+VDD_PLL: 3 - Position2Go_RF_Section (9 pins), 5 - Position2Go_PowerSupply_and_Connectors (R120.2)
+VDD_RF: 2 - Position2Go_Microcontroller (L2.1), 3 - Position2Go_RF_Section (7 pins), 4 - Position2Go_Baseband (C57.1 C76.1 U26.A2 U27.A2), 5 - Position2Go_PowerSupply_and_Connectors (C48.1 R54.1 U24.A2)
+VDD_uP: 2 - Position2Go_Microcontroller (11 pins), 5 - Position2Go_PowerSupply_and_Connectors (L1.2), 6 - Position2Go_Debugger (R133.2 R_1.2)
GND_POWER: 2 - Position2Go_Microcontroller (26 pins), 3 - Position2Go_RF_Section (46 pins), 4 - Position2Go_Baseband (24 pins), 5 - Position2Go_PowerSupply_and_Connectors (25 pins), 6 - Position2Go_Debugger (31 pins)
NetC14_1: 2 - Position2Go_Microcontroller (C14.1 U1.P4), 3 - Position2Go_RF_Section (R30.1)
NetC16_1: 2 - Position2Go_Microcontroller (C16.1 R18.1), 3 - Position2Go_RF_Section (R35.2 U20.D2)
NetC17_1: 2 - Position2Go_Microcontroller (C17.1 R17.1), 3 - Position2Go_RF_Section (R31.2 U20.A1)
NetC43_2: 2 - Position2Go_Microcontroller (R49.2), 3 - Position2Go_RF_Section (C43.2 U21.3)
NetC47_2: 2 - Position2Go_Microcontroller (U1.M2), 4 - Position2Go_Baseband (5 pins)
NetC49_1: 3 - Position2Go_RF_Section (U5.28), 4 - Position2Go_Baseband (C49.1)
NetC52_1: 3 - Position2Go_RF_Section (U5.29), 4 - Position2Go_Baseband (C52.1)
NetC56_2: 2 - Position2Go_Microcontroller (U1.K2), 4 - Position2Go_Baseband (5 pins)
NetC60_1: 3 - Position2Go_RF_Section (U5.31), 4 - Position2Go_Baseband (C60.1)
NetC61_1: 3 - Position2Go_RF_Section (U5.30), 4 - Position2Go_Baseband (C61.1)
NetC66_2: 2 - Position2Go_Microcontroller (U1.J3), 4 - Position2Go_Baseband (5 pins)
NetC67_1: 3 - Position2Go_RF_Section (U5.15), 4 - Position2Go_Baseband (C67.1)
NetC70_1: 3 - Position2Go_RF_Section (U5.14), 4 - Position2Go_Baseband (C70.1)
NetC73_2: 2 - Position2Go_Microcontroller (U1.N6), 4 - Position2Go_Baseband (5 pins)
NetC77_1: 3 - Position2Go_RF_Section (U5.12), 4 - Position2Go_Baseband (C77.1)
NetC78_1: 3 - Position2Go_RF_Section (U5.13), 4 - Position2Go_Baseband (C78.1)
NetC93_1: 2 - Position2Go_Microcontroller (U1.J2), 4 - Position2Go_Baseband (C93.1 R79.2 R111.2)
NetC94_1: 2 - Position2Go_Microcontroller (U1.P6), 4 - Position2Go_Baseband (C94.1 R87.2 R110.2)
NetC95_1: 2 - Position2Go_Microcontroller (U1.K3), 4 - Position2Go_Baseband (C95.1 R70.2 R112.2)
NetC96_1: 2 - Position2Go_Microcontroller (U1.M1), 4 - Position2Go_Baseband (C96.1 R59.2 R113.2)
NetJ1_1: 2 - Position2Go_Microcontroller (R109.2), 3 - Position2Go_RF_Section (U7.16), 5 - Position2Go_PowerSupply_and_Connectors (J1.1)
NetJ1_2: 2 - Position2Go_Microcontroller (R13.1), 3 - Position2Go_RF_Section (U5.20 U7.15), 5 - Position2Go_PowerSupply_and_Connectors (J1.2)
NetJ1_3: 2 - Position2Go_Microcontroller (R11.1), 3 - Position2Go_RF_Section (U5.19 U7.14), 4 - Position2Go_Baseband (R60.2), 5 - Position2Go_PowerSupply_and_Connectors (J1.3)
NetJ1_4: 2 - Position2Go_Microcontroller (R12.1), 3 - Position2Go_RF_Section (U5.18), 5 - Position2Go_PowerSupply_and_Connectors (J1.4)
NetJ1_5: 3 - Position2Go_RF_Section (R130.2), 5 - Position2Go_PowerSupply_and_Connectors (J1.5)
NetJ1_6: 2 - Position2Go_Microcontroller (R106.1), 5 - Position2Go_PowerSupply_and_Connectors (J1.6)
NetJ1_7: 2 - Position2Go_Microcontroller (U1.E4), 5 - Position2Go_PowerSupply_and_Connectors (J1.7)
NetJ1_8: 2 - Position2Go_Microcontroller (U1.J14), 5 - Position2Go_PowerSupply_and_Connectors (J1.8)
NetJ1_9: 2 - Position2Go_Microcontroller (U1.M9), 5 - Position2Go_PowerSupply_and_Connectors (J1.9)
NetJ1_10: 2 - Position2Go_Microcontroller (U1.K14), 5 - Position2Go_PowerSupply_and_Connectors (J1.10)
NetJ1_11: 2 - Position2Go_Microcontroller (U1.L14), 5 - Position2Go_PowerSupply_and_Connectors (J1.11)
NetJ1_12: 2 - Position2Go_Microcontroller (U1.N14), 5 - Position2Go_PowerSupply_and_Connectors (J1.12)
NetJ2_1: 4 - Position2Go_Baseband (R127.1), 5 - Position2Go_PowerSupply_and_Connectors (J2.1)
NetJ2_2: 4 - Position2Go_Baseband (R128.1), 5 - Position2Go_PowerSupply_and_Connectors (J2.2)
NetJ2_3: 2 - Position2Go_Microcontroller (R123.2 U1.P5), 5 - Position2Go_PowerSupply_and_Connectors (J2.3)
NetJ2_4: 2 - Position2Go_Microcontroller (R124.2 U1.N5), 5 - Position2Go_PowerSupply_and_Connectors (J2.4)
NetJ2_5: 2 - Position2Go_Microcontroller (U1.F9), 3 - Position2Go_RF_Section (R33.2), 5 - Position2Go_PowerSupply_and_Connectors (J2.5)
NetJ2_6: 2 - Position2Go_Microcontroller (U1.E11), 3 - Position2Go_RF_Section (U7.12), 5 - Position2Go_PowerSupply_and_Connectors (J2.6)
NetJ2_7: 4 - Position2Go_Baseband (R113.1), 5 - Position2Go_PowerSupply_and_Connectors (J2.7)
NetJ2_8: 4 - Position2Go_Baseband (R112.1), 5 - Position2Go_PowerSupply_and_Connectors (J2.8)
NetJ2_9: 4 - Position2Go_Baseband (R111.1), 5 - Position2Go_PowerSupply_and_Connectors (J2.9)
NetJ2_10: 4 - Position2Go_Baseband (R110.1), 5 - Position2Go_PowerSupply_and_Connectors (J2.10)
NetJ2_11: 3 - Position2Go_RF_Section (R129.2), 5 - Position2Go_PowerSupply_and_Connectors (J2.11)
NetJ2_12: 4 - Position2Go_Baseband (R126.1), 5 - Position2Go_PowerSupply_and_Connectors (J2.12)
NetJ2_13: 4 - Position2Go_Baseband (R125.1), 5 - Position2Go_PowerSupply_and_Connectors (J2.13)
NetJ3_2: 2 - Position2Go_Microcontroller (R9.1), 5 - Position2Go_PowerSupply_and_Connectors (J3.2 TS1.1)
NetJ3_3: 2 - Position2Go_Microcontroller (R8.1), 5 - Position2Go_PowerSupply_and_Connectors (J3.3 TS1.2)
NetJ6_2: 2 - Position2Go_Microcontroller (U1.J7), 6 - Position2Go_Debugger (J6.2 R_1.1 R_2.2 R_33.2)
NetJ6_4: 2 - Position2Go_Microcontroller (U1.J8), 6 - Position2Go_Debugger (J6.4 R_34.2 U32.22)
NetJ6_6: 2 - Position2Go_Microcontroller (U1.M12), 6 - Position2Go_Debugger (J6.6 U32.2 U32.24)
NetJ6_10: 2 - Position2Go_Microcontroller (R135.1 U1.J11), 6 - Position2Go_Debugger (J6.10 U32.47)
NetQ1_3: 2 - Position2Go_Microcontroller (R104.2), 3 - Position2Go_RF_Section (Q1.3 R116.2 R118.2)
NetR24_1: 2 - Position2Go_Microcontroller (U1.N13), 3 - Position2Go_RF_Section (R24.1)
NetR34_1: 2 - Position2Go_Microcontroller (U1.M14), 3 - Position2Go_RF_Section (R34.1)
NetR37_1: 2 - Position2Go_Microcontroller (U1.N9), 3 - Position2Go_RF_Section (R37.1)
NetR55_2: 4 - Position2Go_Baseband (6 pins), 5 - Position2Go_PowerSupply_and_Connectors (R56.2)
NetR61_2: 2 - Position2Go_Microcontroller (R108.1), 4 - Position2Go_Baseband (R61.2)
NetR63_2: 2 - Position2Go_Microcontroller (R103.1), 4 - Position2Go_Baseband (R63.2)
NetR64_2: 4 - Position2Go_Baseband (6 pins), 5 - Position2Go_PowerSupply_and_Connectors (R64.2)
NetR91_2: 2 - Position2Go_Microcontroller (U1.F3), 6 - Position2Go_Debugger (R91.2)
NetR105_2: 2 - Position2Go_Microcontroller (R105.2), 3 - Position2Go_RF_Section (R131.2 U7.13)
NetR107_1: 2 - Position2Go_Microcontroller (R107.1), 3 - Position2Go_RF_Section (U23.4)
NetR119_1: 2 - Position2Go_Microcontroller (R119.1), 5 - Position2Go_PowerSupply_and_Connectors (U28.B1)
NetR132_1: 2 - Position2Go_Microcontroller (U1.N4), 3 - Position2Go_RF_Section (R132.1)
NetR134_2: 2 - Position2Go_Microcontroller (R134.2), 6 - Position2Go_Debugger (U32.46)
NetU1_E12: 2 - Position2Go_Microcontroller (U1.E12), 3 - Position2Go_RF_Section (U7.20)
NetU1_G9: 2 - Position2Go_Microcontroller (U1.G9), 3 - Position2Go_RF_Section (U7.21)